# EAGLE design v3s-v0.1.2 (EAGLE 9.2.0)

## Sheet 1 of 5
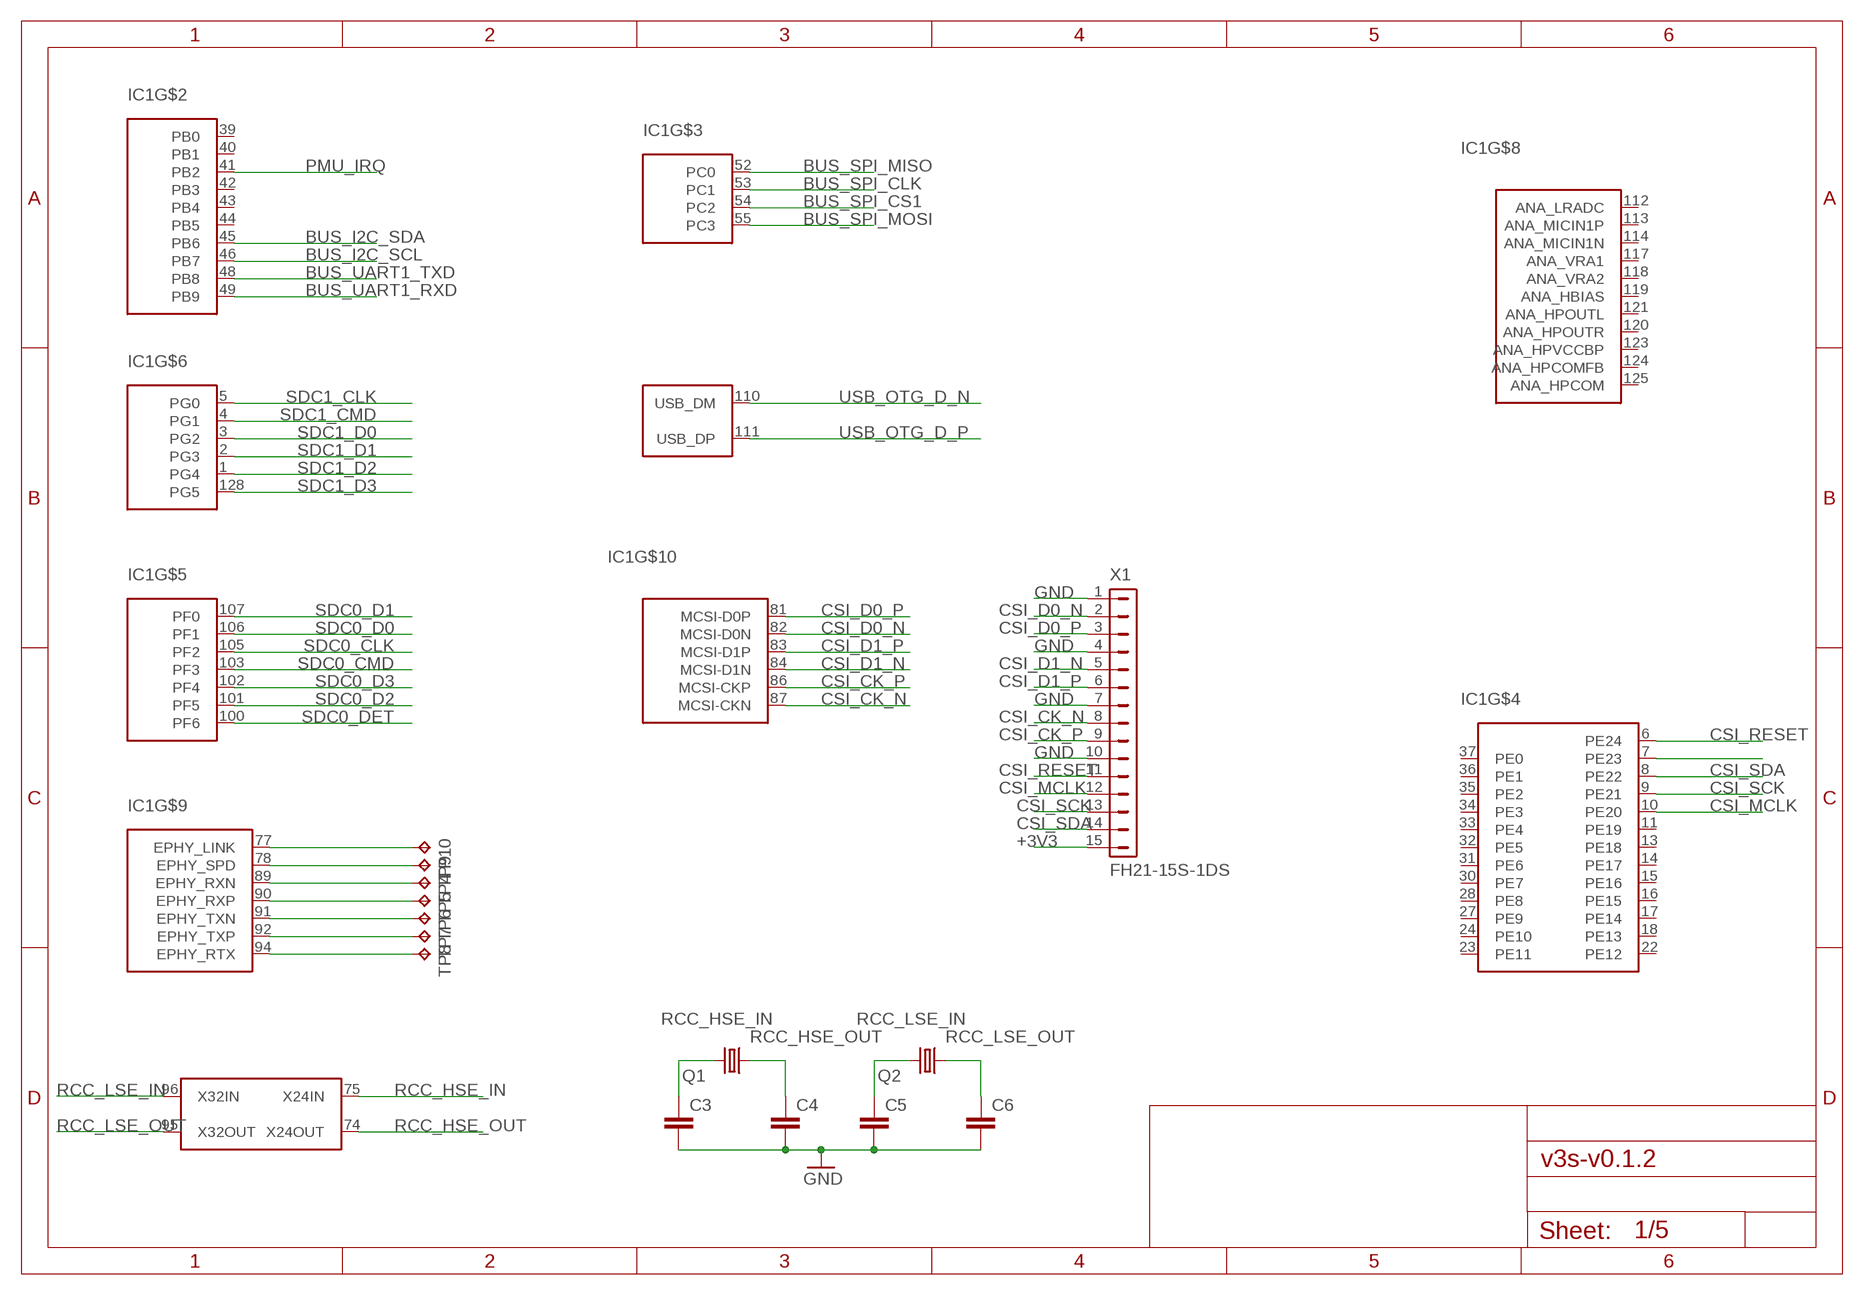
[diagram p0: schematic, sheet 1]

### Parts
C3  C-EUC0402  [C0402]
C4  C-EUC0402  [C0402]
C5  C-EUC0402  [C0402]
C6  C-EUC0402  [C0402]
IC1  V3S  [QFP-128]
Q1  KX-7  [3.2X2.5_KX-7]
Q2  KX-327-NHF  [3.2X1.5]
TP4  TPB1,27  [B1,27]
TP5  TPB1,27  [B1,27]
TP6  TPB1,27  [B1,27]
TP7  TPB1,27  [B1,27]
TP8  TPB1,27  [B1,27]
TP9  TPB1,27  [B1,27]
TP10  TPB1,27  [B1,27]
X1  FH21-15S-1DS  [FH21-15S-1DS]

### Nets
+3V3: X1.15 ; also sheet 2,3,4,5
BUS_I2C_SCL: IC1.46(PB7) ; also sheet 3,4,5
BUS_I2C_SDA: IC1.45(PB6) ; also sheet 3,4,5
BUS_SPI_CLK: IC1.53(PC1) ; also sheet 4
BUS_SPI_CS1: IC1.54(PC2)
BUS_SPI_MISO: IC1.52(PC0) ; also sheet 4
BUS_SPI_MOSI: IC1.55(PC3) ; also sheet 4
BUS_UART1_RXD: IC1.49(PB9) ; also sheet 4
BUS_UART1_TXD: IC1.48(PB8) ; also sheet 4
CSI_CK_N: IC1.87(MCSI-CKN) X1.8
CSI_CK_P: IC1.86(MCSI-CKP) X1.9
CSI_D0_N: IC1.82(MCSI-D0N) X1.2
CSI_D0_P: IC1.81(MCSI-D0P) X1.3
CSI_D1_N: IC1.84(MCSI-D1N) X1.5
CSI_D1_P: IC1.83(MCSI-D1P) X1.6
CSI_MCLK: IC1.10(PE20) X1.12
CSI_RESET: IC1.6(PE24) X1.11
CSI_SCK: IC1.9(PE21) X1.13
CSI_SDA: IC1.8(PE22) X1.14
GND: C3.2 C4.2 C5.2 C6.2 X1.1 X1.4 X1.7 X1.10 ; also sheet 2,3,4,5
N$23: IC1.78(EPHY_SPD) TP9.TP
N$24: IC1.77(EPHY_LINK) TP10.TP
N$26: IC1.7(PE23)
N$37: IC1.94(EPHY_RTX) TP8.TP
N$38: IC1.92(EPHY_TXP) TP7.TP
N$39: IC1.91(EPHY_TXN) TP6.TP
N$40: IC1.90(EPHY_RXP) TP5.TP
N$41: IC1.89(EPHY_RXN) TP4.TP
PMU_IRQ: IC1.41(PB2) ; also sheet 3
RCC_HSE_IN: C3.1 IC1.75(X24IN) Q1.3
RCC_HSE_OUT: C4.1 IC1.74(X24OUT) Q1.1
RCC_LSE_IN: C5.1 IC1.96(X32IN) Q2.2
RCC_LSE_OUT: C6.1 IC1.95(X32OUT) Q2.1
SDC0_CLK: IC1.105(PF2) ; also sheet 4
SDC0_CMD: IC1.103(PF3) ; also sheet 4
SDC0_D0: IC1.106(PF1) ; also sheet 4
SDC0_D1: IC1.107(PF0) ; also sheet 4
SDC0_D2: IC1.101(PF5) ; also sheet 4
SDC0_D3: IC1.102(PF4) ; also sheet 4
SDC0_DET: IC1.100(PF6) ; also sheet 4
SDC1_CLK: IC1.5(PG0) ; also sheet 4
SDC1_CMD: IC1.4(PG1) ; also sheet 4
SDC1_D0: IC1.3(PG2) ; also sheet 4
SDC1_D1: IC1.2(PG3) ; also sheet 4
SDC1_D2: IC1.1(PG4) ; also sheet 4
SDC1_D3: IC1.128(PG5) ; also sheet 4
USB_OTG_D_N [usb_df]: IC1.110(USB_DM) ; also sheet 4
USB_OTG_D_P [usb_df]: IC1.111(USB_DP) ; also sheet 4
Unconnected: IC1.11(PE19) IC1.13(PE18) IC1.14(PE17) IC1.15(PE16) IC1.16(PE15) IC1.17(PE14) IC1.18(PE13) IC1.22(PE12) IC1.23(PE11) IC1.24(PE10) IC1.27(PE9) IC1.28(PE8) IC1.30(PE7) IC1.31(PE6) IC1.32(PE5) IC1.33(PE4) IC1.34(PE3) IC1.35(PE2) IC1.36(PE1) IC1.37(PE0) IC1.39(PB0) IC1.40(PB1) IC1.42(PB3) IC1.43(PB4) IC1.44(PB5) IC1.112(ANA_LRADC) IC1.113(ANA_MICIN1P) IC1.114(ANA_MICIN1N) IC1.117(ANA_VRA1) IC1.118(ANA_VRA2) IC1.119(ANA_HBIAS) IC1.120(ANA_HPOUTR) IC1.121(ANA_HPOUTL) IC1.123(ANA_HPVCCBP) IC1.124(ANA_HPCOMFB) IC1.125(ANA_HPCOM)

## Sheet 2 of 5
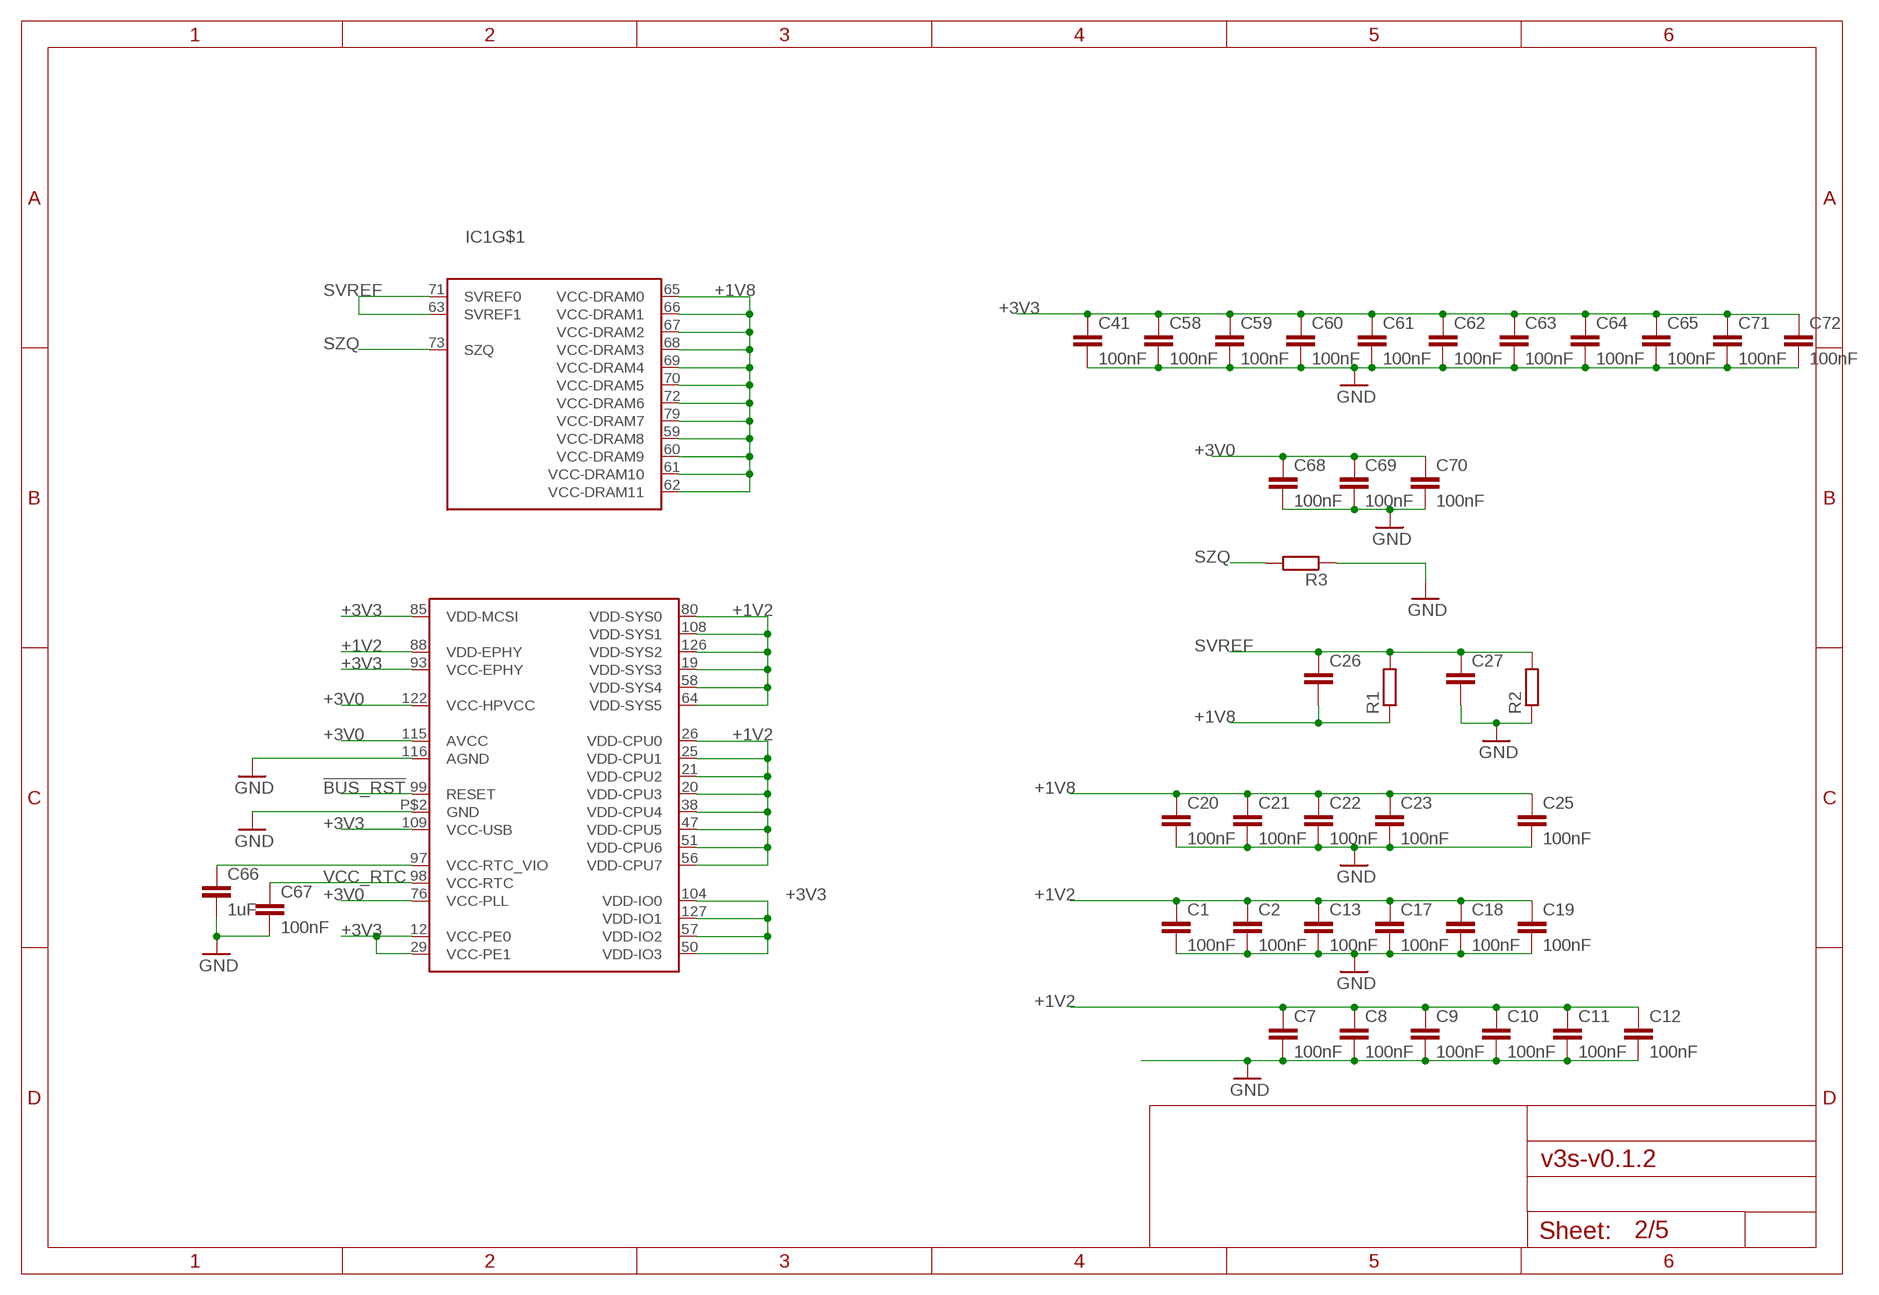
[diagram p1: schematic, sheet 2]

### Parts
C1  100nF  C-EUC0402  [C0402]
C2  100nF  C-EUC0402  [C0402]
C7  100nF  C-EUC0402  [C0402]
C8  100nF  C-EUC0402  [C0402]
C9  100nF  C-EUC0402  [C0402]
C10  100nF  C-EUC0402  [C0402]
C11  100nF  C-EUC0402  [C0402]
C12  100nF  C-EUC0402  [C0402]
C13  100nF  C-EUC0402  [C0402]
C17  100nF  C-EUC0402  [C0402]
C18  100nF  C-EUC0402  [C0402]
C19  100nF  C-EUC0402  [C0402]
C20  100nF  C-EUC0402  [C0402]
C21  100nF  C-EUC0402  [C0402]
C22  100nF  C-EUC0402  [C0402]
C23  100nF  C-EUC0402  [C0402]
C25  100nF  C-EUC0402  [C0402]
C26  C-EUC0402  [C0402]
C27  C-EUC0402  [C0402]
C41  100nF  C-EUC0402  [C0402]
C58  100nF  C-EUC0402  [C0402]
C59  100nF  C-EUC0402  [C0402]
C60  100nF  C-EUC0402  [C0402]
C61  100nF  C-EUC0402  [C0402]
C62  100nF  C-EUC0402  [C0402]
C63  100nF  C-EUC0402  [C0402]
C64  100nF  C-EUC0402  [C0402]
C65  100nF  C-EUC0402  [C0402]
C66  1uF  C-EUC0402  [C0402]
C67  100nF  C-EUC0402  [C0402]
C68  100nF  C-EUC0402  [C0402]
C69  100nF  C-EUC0402  [C0402]
C70  100nF  C-EUC0402  [C0402]
C71  100nF  C-EUC0402  [C0402]
C72  100nF  C-EUC0402  [C0402]
R1  R-EU_R0402  [R0402]
R2  R-EU_R0402  [R0402]
R3  R-EU_R0402  [R0402]

### Nets
!BUS_RST: IC1.99(RESET) ; also sheet 3,4
+1V2: C1.1 C2.1 C7.1 C8.1 C9.1 C10.1 C11.1 C12.1 C13.1 C17.1 C18.1 C19.1 IC1.19(VDD-SYS3) IC1.20(VDD-CPU3) IC1.21(VDD-CPU2) IC1.25(VDD-CPU1) IC1.26(VDD-CPU0) IC1.38(VDD-CPU4) IC1.47(VDD-CPU5) IC1.51(VDD-CPU6) IC1.56(VDD-CPU7) IC1.58(VDD-SYS4) IC1.64(VDD-SYS5) IC1.80(VDD-SYS0) IC1.88(VDD-EPHY) IC1.108(VDD-SYS1) IC1.126(VDD-SYS2) ; also sheet 3
+1V8: C20.1 C21.1 C22.1 C23.1 C25.1 C26.2 IC1.59(VCC-DRAM8) IC1.60(VCC-DRAM9) IC1.61(VCC-DRAM10) IC1.62(VCC-DRAM11) IC1.65(VCC-DRAM0) IC1.66(VCC-DRAM1) IC1.67(VCC-DRAM2) IC1.68(VCC-DRAM3) IC1.69(VCC-DRAM4) IC1.70(VCC-DRAM5) IC1.72(VCC-DRAM6) IC1.79(VCC-DRAM7) R1.1 ; also sheet 3
+3V0: C68.1 C69.1 C70.1 IC1.76(VCC-PLL) IC1.115(AVCC) IC1.122(VCC-HPVCC) ; also sheet 3
+3V3: C41.1 C58.1 C59.1 C60.1 C61.1 C62.1 C63.1 C64.1 C65.1 C71.1 C72.1 IC1.12(VCC-PE0) IC1.29(VCC-PE1) IC1.50(VDD-IO3) IC1.57(VDD-IO2) IC1.85(VDD-MCSI) IC1.93(VCC-EPHY) IC1.104(VDD-IO0) IC1.109(VCC-USB) IC1.127(VDD-IO1) ; also sheet 1,3,4,5
GND: C1.2 C2.2 C7.2 C8.2 C9.2 C10.2 C11.2 C12.2 C13.2 C17.2 C18.2 C19.2 C20.2 C21.2 C22.2 C23.2 C25.2 C27.2 C41.2 C58.2 C59.2 C60.2 C61.2 C62.2 C63.2 C64.2 C65.2 C66.2 C67.2 C68.2 C69.2 C70.2 C71.2 C72.2 IC1.116(AGND) IC1.P$2(GND) R2.1 R3.1 ; also sheet 1,3,4,5
N$25: C66.1 IC1.97(VCC-RTC_VIO)
SVREF: C26.1 C27.1 IC1.63(SVREF1) IC1.71(SVREF0) R1.2 R2.2
SZQ: IC1.73(SZQ) R3.2
VCC_RTC: C67.1 IC1.98(VCC-RTC) ; also sheet 3

## Sheet 3 of 5
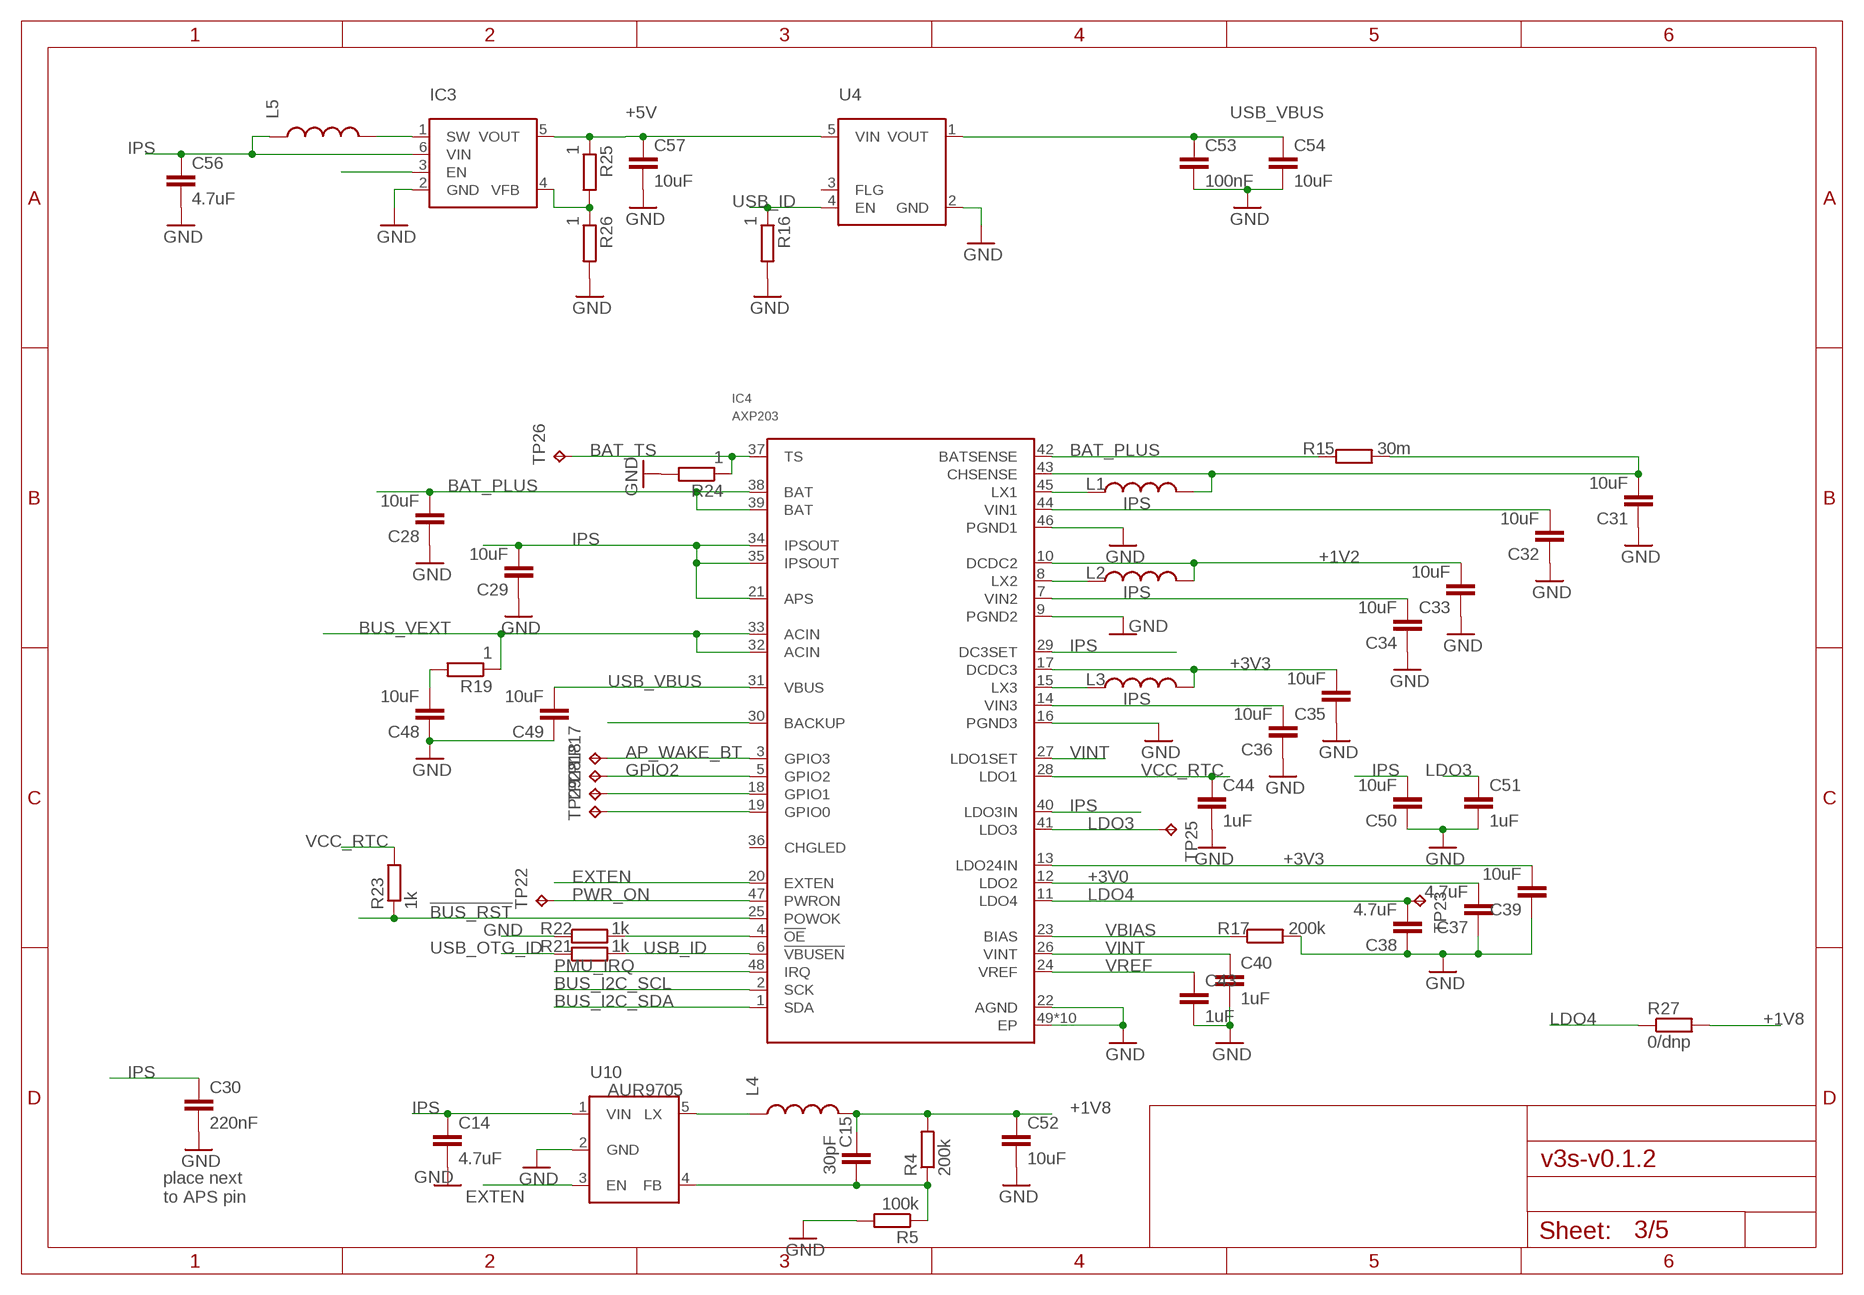
[diagram p2: schematic, sheet 3]

### Parts
C14  4.7uF  C-EUC0603  [C0603]
C15  30pF  C-EUC0402  [C0402]
C28  10uF  C-EUC0603  [C0603]
C29  10uF  C-EUC0603  [C0603]
C30  220nF  C-EUC0402  [C0402]
C31  10uF  C-EUC0603  [C0603]
C32  10uF  C-EUC0603  [C0603]
C33  10uF  C-EUC0603  [C0603]
C34  10uF  C-EUC0603  [C0603]
C35  10uF  C-EUC0603  [C0603]
C36  10uF  C-EUC0603  [C0603]
C37  4.7uF  C-EUC0603  [C0603]
C38  4.7uF  C-EUC0603  [C0603]
C39  10uF  C-EUC0603  [C0603]
C40  1uF  C-EUC0402  [C0402]
C43  1uF  C-EUC0402  [C0402]
C44  1uF  C-EUC0402  [C0402]
C48  10uF  C-EUC0603  [C0603]
C49  10uF  C-EUC0603  [C0603]
C50  10uF  C-EUC0603  [C0603]
C51  1uF  C-EUC0402  [C0402]
C52  10uF  C-EUC0603  [C0603]
C53  100nF  C-EUC0402  [C0402]
C54  10uF  C-EUC0603  [C0603]
C56  4.7uF  C-EUC0603  [C0603]
C57  10uF  C-EUC0603  [C0603]
IC3  MCP1640  [SOT95P280X110-6]
IC4  AXP203  [QFN40P600X600X80-49T405]
L1  DJNR3015  [L3230M]
L2  DJNR3015  [L3230M]
L3  DJNR3015  [L3230M]
L4  DJNR3015  [L3230M]
L5  DJNR3015  [L3230M]
R4  200k  R-EU_R0402  [R0402]
R5  100k  R-EU_R0402  [R0402]
R15  30m  R-EU_R0805  [R0805]
R16  1  R-EU_R0402  [R0402]
R17  200k  R-EU_R0402  [R0402]
R19  1  R-EU_R0402  [R0402]
R21  1k  R-EU_R0402  [R0402]
R22  1k  R-EU_R0402  [R0402]
R23  1k  R-EU_R0402  [R0402]
R24  1  R-EU_R0402  [R0402]
R25  1  R-EU_R0402  [R0402]
R26  1  R-EU_R0402  [R0402]
R27  0/dnp  R-EU_R0402  [R0402]
TP17  TPB1,27  [B1,27]
TP18  TPB1,27  [B1,27]
TP22  TPB1,27  [B1,27]
TP23  TPB1,27  [B1,27]
TP25  TPB1,27  [B1,27]
TP26  TPB1,27  [B1,27]
TP28  TPB1,27  [B1,27]
TP29  TPB1,27  [B1,27]
U4  AP22802  [SOT25]
U10  AUR9705  [SOT25]

### Nets
!BUS_RST: IC4.25(POWOK) R23.1 ; also sheet 2,4
+1V2: C33.2 IC4.10(DCDC2) L2.2 ; also sheet 2
+1V8: C15.1 C52.1 L4.2 R4.2 R27.2 ; also sheet 2
+3V0: C37.2 IC4.12(LDO2) ; also sheet 2
+3V3: C35.2 C39.2 IC4.13(LDO24IN) IC4.17(DCDC3) L3.2 ; also sheet 1,2,4,5
+5V: C57.1 IC3.5(VOUT) R25.1 U4.5(VIN)
AP_WAKE_BT: IC4.3(GPIO3) TP17.TP
BAT_PLUS: C28.2 IC4.38(BAT) IC4.39(BAT) IC4.42(BATSENSE) R15.1 ; also sheet 4,5
BAT_TS: IC4.37(TS) R24.1 TP26.TP
BUS_I2C_SCL: IC4.2(SCK) ; also sheet 1,4,5
BUS_I2C_SDA: IC4.1(SDA) ; also sheet 1,4,5
BUS_VEXT: IC4.32(ACIN) IC4.33(ACIN) R19.1 ; also sheet 4
EXTEN: IC4.20(EXTEN) U10.3(EN)
GND: C14.2 C28.1 C29.1 C30.2 C31.1 C32.1 C33.1 C34.1 C35.1 C36.1 C37.1 C38.1 C39.1 C40.2 C43.2 C44.2 C48.1 C49.1 C50.1 C51.2 C52.2 C53.2 C54.2 C56.2 C57.2 IC3.2(GND) IC4.9(PGND2) IC4.16(PGND3) IC4.22(AGND) IC4.46(PGND1) IC4.49(EP) IC4.P$1(EP) IC4.P$2(EP) IC4.P$3(EP) IC4.P$4(EP) IC4.P$5(EP) IC4.P$6(EP) IC4.P$7(EP) IC4.P$8(EP) IC4.P$9(EP) R5.2 R16.2 R17.2 R22.1 R24.2 R26.2 U4.2(GND) U10.2(GND) ; also sheet 1,2,4,5
GPIO2: IC4.5(GPIO2) TP18.TP
IPS: C14.1 C29.2 C30.1 C32.2 C34.2 C36.2 C50.2 C56.1 IC3.6(VIN) IC4.7(VIN2) IC4.14(VIN3) IC4.21(APS) IC4.29(DC3SET) IC4.34(IPSOUT) IC4.35(IPSOUT) IC4.40(LDO3IN) IC4.44(VIN1) L5.1 U10.1(VIN)
LDO3: C51.1 IC4.41(LDO3) TP25.TP
LDO4: C38.2 IC4.11(LDO4) R27.1 TP23.TP
N$3: IC4.15(LX3) L3.1
N$4: IC4.18(GPIO1) TP28.TP
N$5: IC4.19(GPIO0) TP29.TP
N$6: L4.1 U10.5(LX)
N$8: C15.2 R4.1 R5.1 U10.4(FB)
N$9: IC4.30(BACKUP)
N$14: IC3.1(SW) L5.2
N$16: IC3.3(EN)
N$17: IC4.8(LX2) L2.1
N$19: IC3.4(VFB) R25.2 R26.1
N$20: IC4.45(LX1) L1.1
N$21: C31.2 IC4.43(CHSENSE) L1.2 R15.2
N$31: IC4.4(!OE) R22.2
N$68: C48.2 R19.2
PMU_IRQ: IC4.48(IRQ) ; also sheet 1
PWR_ON: IC4.47(PWRON) TP22.TP
USB_ID: IC4.6(!VBUSEN) R16.1 R21.2 U4.4(EN)
USB_OTG_ID: R21.1 ; also sheet 4
USB_VBUS: C49.2 C53.1 C54.1 IC4.31(VBUS) U4.1(VOUT) ; also sheet 4
VBIAS: IC4.23(BIAS) R17.1
VCC_RTC: C44.1 IC4.28(LDO1) R23.2 ; also sheet 2
VINT: C40.1 IC4.26(VINT) IC4.27(LDO1SET)
VREF: C43.1 IC4.24(VREF)
Unconnected: IC4.36(CHGLED) U4.3(FLG)

### Notes on the sheet
- place next
  to APS pin

## Sheet 4 of 5
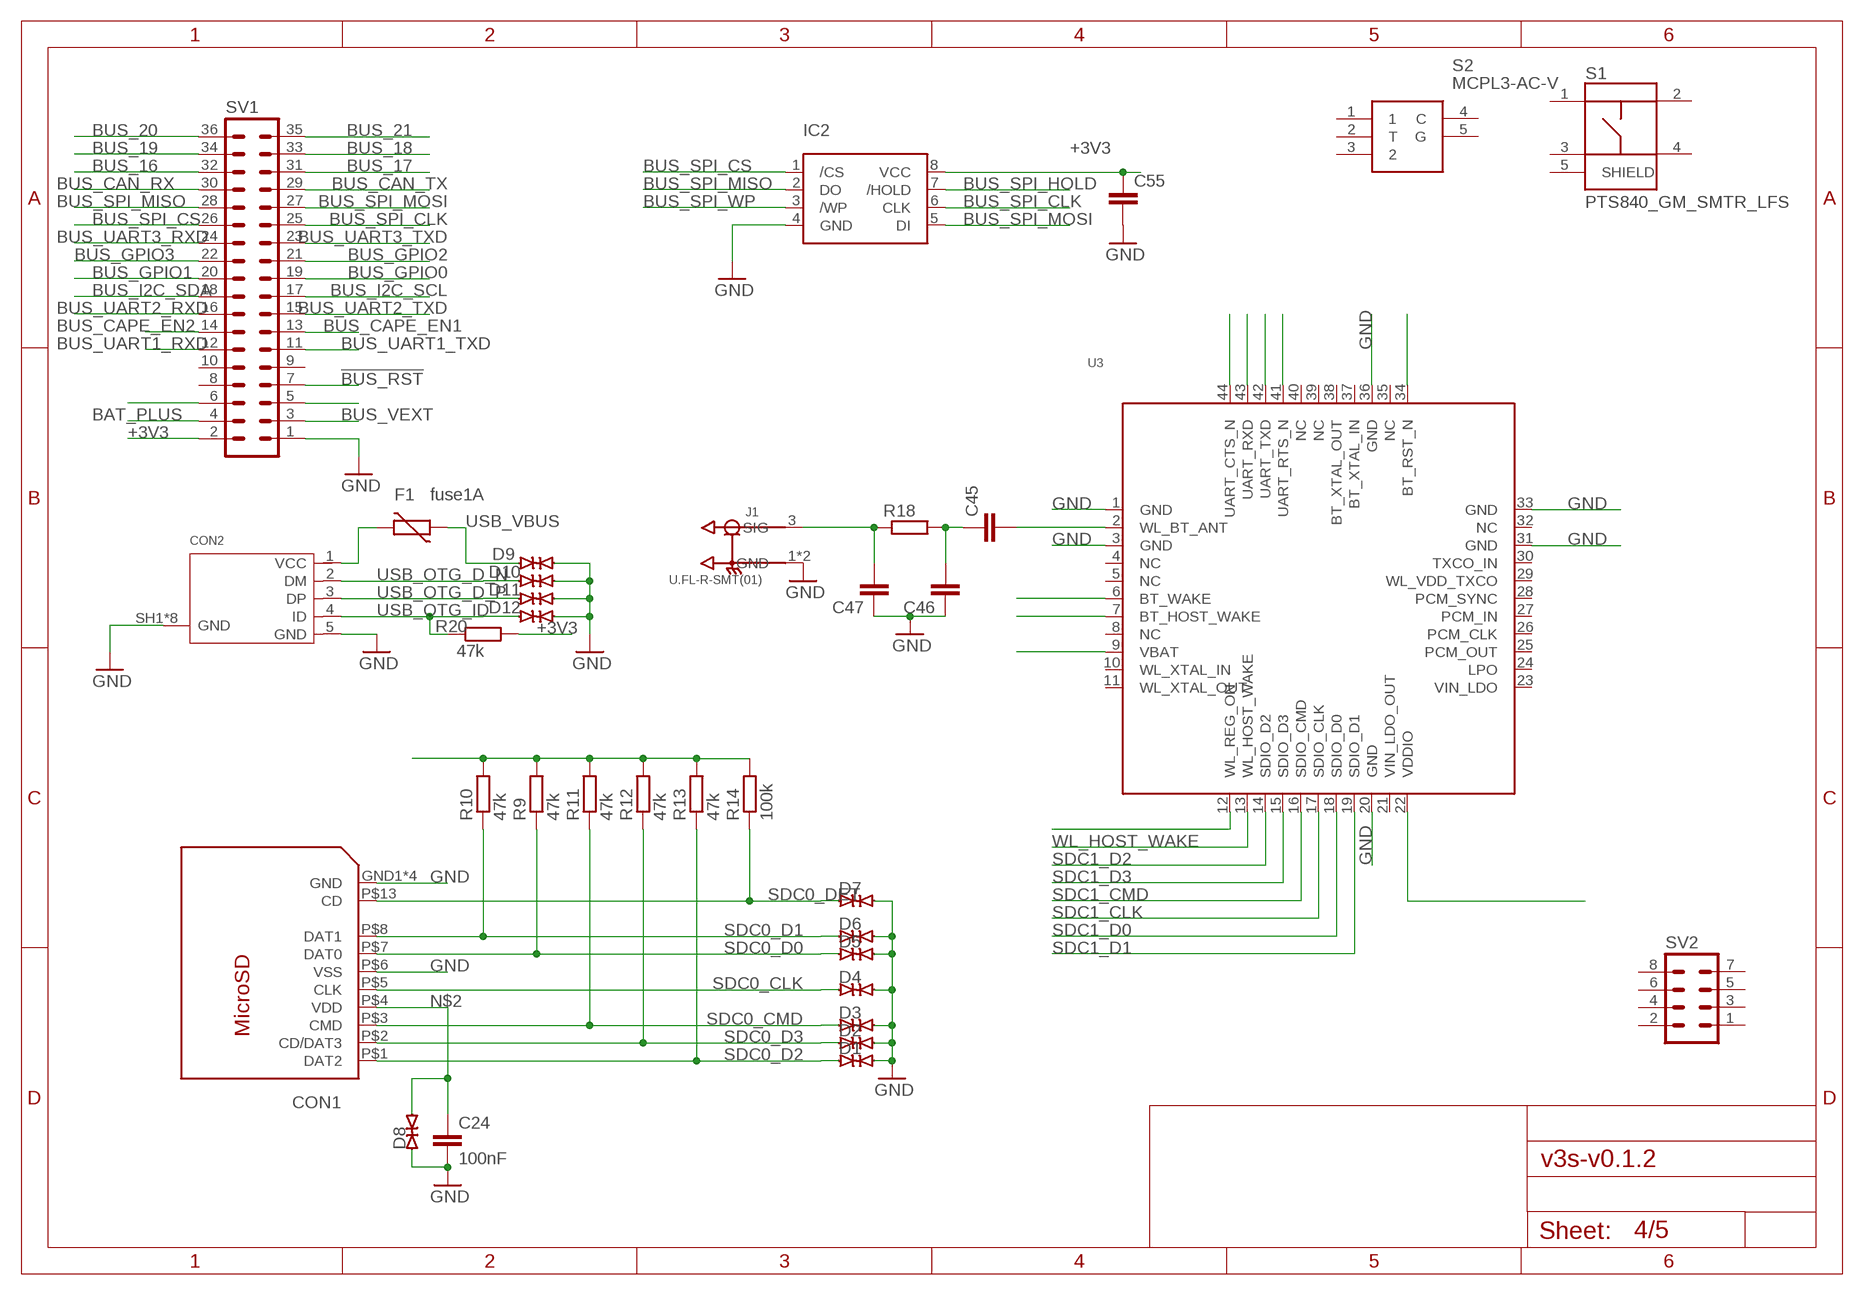
[diagram p3: schematic, sheet 4]

### Parts
C24  100nF  C-EUC0402  [C0402]
C45  C-EUC0402  [C0402]
C46  C-EUC0402  [C0402]
C47  C-EUC0402  [C0402]
C55  C-EUC0603  [C0603]
CON1  112J-TXAR  [112J]
CON2  10118194-0001LF  [10118194]
D1  ESD9B5.0ST5G  [SOD1006X40]
D2  ESD9B5.0ST5G  [SOD1006X40]
D3  ESD9B5.0ST5G  [SOD1006X40]
D4  ESD9B5.0ST5G  [SOD1006X40]
D5  ESD9B5.0ST5G  [SOD1006X40]
D6  ESD9B5.0ST5G  [SOD1006X40]
D7  ESD9B5.0ST5G  [SOD1006X40]
D8  ESD9B5.0ST5G  [SOD1006X40]
D9  ESD9B5.0ST5G  [SOD1006X40]
D10  ESD9B5.0ST5G  [SOD1006X40]
D11  ESD9B5.0ST5G  [SOD1006X40]
D12  ESD9B5.0ST5G  [SOD1006X40]
F1  fuse1A  VARISTORCN0603  [CT/CN0603]
IC2  W25Q128JV  [SO08-208]
J1  U.FL-R-SMT(01)  [HRS_U.FL-R-SMT(01)]
R9  47k  R-EU_R0402  [R0402]
R10  47k  R-EU_R0402  [R0402]
R11  47k  R-EU_R0402  [R0402]
R12  47k  R-EU_R0402  [R0402]
R13  47k  R-EU_R0402  [R0402]
R14  100k  R-EU_R0402  [R0402]
R18  R-EU_R0402  [R0402]
R20  47k  R-EU_R0402  [R0402]
S1  PTS840_GM_SMTR_LFS  [SW_PTS840GMSMTRLFS]
S2  MCPL3-AC-V  [MCPL3-AC-V]
SV1  MA18-2  [MA18-2]
SV2  MA04-2  [MA04-2]
U3  RTL8723BS  [QFN90P1200X1200X100-44]

### Nets
!BUS_RST: SV1.7 ; also sheet 2,3
+3V3: C55.1 IC2.8(VCC) R20.2 SV1.2 ; also sheet 1,2,3,5
BAT_PLUS: SV1.4 ; also sheet 3,5
BUS_16: SV1.32
BUS_17: SV1.31
BUS_18: SV1.33
BUS_19: SV1.34
BUS_20: SV1.36
BUS_21: SV1.35
BUS_CAN_RX: SV1.30
BUS_CAN_TX: SV1.29
BUS_CAPE_EN1: SV1.13
BUS_CAPE_EN2: SV1.14
BUS_GPIO0: SV1.19
BUS_GPIO1: SV1.20
BUS_GPIO2: SV1.21
BUS_GPIO3: SV1.22
BUS_I2C_SCL: SV1.17 ; also sheet 1,3,5
BUS_I2C_SDA: SV1.18 ; also sheet 1,3,5
BUS_SPI_CLK: IC2.6(CLK) SV1.25 ; also sheet 1
BUS_SPI_CS: IC2.1(/CS) SV1.26
BUS_SPI_HOLD: IC2.7(/HOLD)
BUS_SPI_MISO: IC2.2(DO) SV1.28 ; also sheet 1
BUS_SPI_MOSI: IC2.5(DI) SV1.27 ; also sheet 1
BUS_SPI_WP: IC2.3(/WP)
BUS_UART1_RXD: SV1.12 ; also sheet 1
BUS_UART1_TXD: SV1.11 ; also sheet 1
BUS_UART2_RXD: SV1.16
BUS_UART2_TXD: SV1.15
BUS_UART3_RXD: SV1.24
BUS_UART3_TXD: SV1.23
BUS_VEXT: SV1.3 ; also sheet 3
GND: C24.2 C46.1 C47.1 C55.2 CON1.GND1(GND) CON1.GND2(GND) CON1.GND3(GND) CON1.GND4(GND) CON1.P$6(VSS) CON2.5(GND) CON2.SH1(GND) CON2.SH2(GND) CON2.SH3(GND) CON2.SH4(GND) CON2.SH5(GND) CON2.SH6(GND) CON2.SH7(GND) CON2.SH8(GND) D1.2(C) D2.2(C) D3.2(C) D4.2(C) D5.2(C) D6.2(C) D7.2(C) D8.1(A) D9.2(C) D10.2(C) D11.2(C) D12.2(C) IC2.4(GND) J1.1(GND) J1.2(GND) SV1.1 U3.1(GND) U3.3(GND) U3.20(GND) U3.31(GND) U3.33(GND) U3.36(GND) ; also sheet 1,2,3,5
N$1: R9.2 R10.2 R11.2 R12.2 R13.2 R14.2
N$2: C24.1 CON1.P$4(VDD) D8.2(C)
N$7: CON2.1(VCC) F1.2
N$15: SV1.6
N$22: SV1.5
N$48: C45.2 U3.2(WL_BT_ANT)
N$49: C45.1 C46.2 R18.2
N$50: C47.2 J1.3(SIG) R18.1
N$51: U3.9(VBAT)
N$53: U3.12(WL_REG_ON)
N$60: U3.22(VDDIO)
N$61: U3.6(BT_WAKE)
N$62: U3.7(BT_HOST_WAKE)
N$63: U3.34(BT_RST_N)
N$64: U3.41(UART_RTS_N)
N$65: U3.42(UART_TXD)
N$66: U3.43(UART_RXD)
N$67: U3.44(UART_CTS_N)
SDC0_CLK: CON1.P$5(CLK) D4.1(A) ; also sheet 1
SDC0_CMD: CON1.P$3(CMD) D3.1(A) R11.1 ; also sheet 1
SDC0_D0: CON1.P$7(DAT0) D5.1(A) R9.1 ; also sheet 1
SDC0_D1: CON1.P$8(DAT1) D6.1(A) R10.1 ; also sheet 1
SDC0_D2: CON1.P$1(DAT2) D1.1(A) R13.1 ; also sheet 1
SDC0_D3: CON1.P$2(CD/DAT3) D2.1(A) R12.1 ; also sheet 1
SDC0_DET: CON1.P$13(CD) D7.1(A) R14.1 ; also sheet 1
SDC1_CLK: U3.17(SDIO_CLK) ; also sheet 1
SDC1_CMD: U3.16(SDIO_CMD) ; also sheet 1
SDC1_D0: U3.18(SDIO_D0) ; also sheet 1
SDC1_D1: U3.19(SDIO_D1) ; also sheet 1
SDC1_D2: U3.14(SDIO_D2) ; also sheet 1
SDC1_D3: U3.15(SDIO_D3) ; also sheet 1
USB_OTG_D_N [usb_df]: CON2.2(DM) D10.1(A) ; also sheet 1
USB_OTG_D_P [usb_df]: CON2.3(DP) D11.1(A) ; also sheet 1
USB_OTG_ID: CON2.4(ID) D12.1(A) R20.1 ; also sheet 3
USB_VBUS: D9.1(A) F1.1 ; also sheet 3
WL_HOST_WAKE: U3.13(WL_HOST_WAKE)
Unconnected: S1.1 S1.2 S1.3 S1.4 S1.5(SHIELD) S2.1 S2.2(T) S2.3 S2.4(C) S2.5(G) SV1.8 SV1.9 SV1.10 SV2.1 SV2.2 SV2.3 SV2.4 SV2.5 SV2.6 SV2.7 SV2.8 U3.4(NC) U3.5(NC) U3.8(NC) U3.10(WL_XTAL_IN) U3.11(WL_XTAL_OUT) U3.21(VIN_LDO_OUT) U3.23(VIN_LDO) U3.24(LPO) U3.25(PCM_OUT) U3.26(PCM_CLK) U3.27(PCM_IN) U3.28(PCM_SYNC) U3.29(WL_VDD_TXCO) U3.30(TXCO_IN) U3.32(NC) U3.35(NC) U3.37(BT_XTAL_IN) U3.38(BT_XTAL_OUT) U3.39(NC) U3.40(NC)

## Sheet 5 of 5
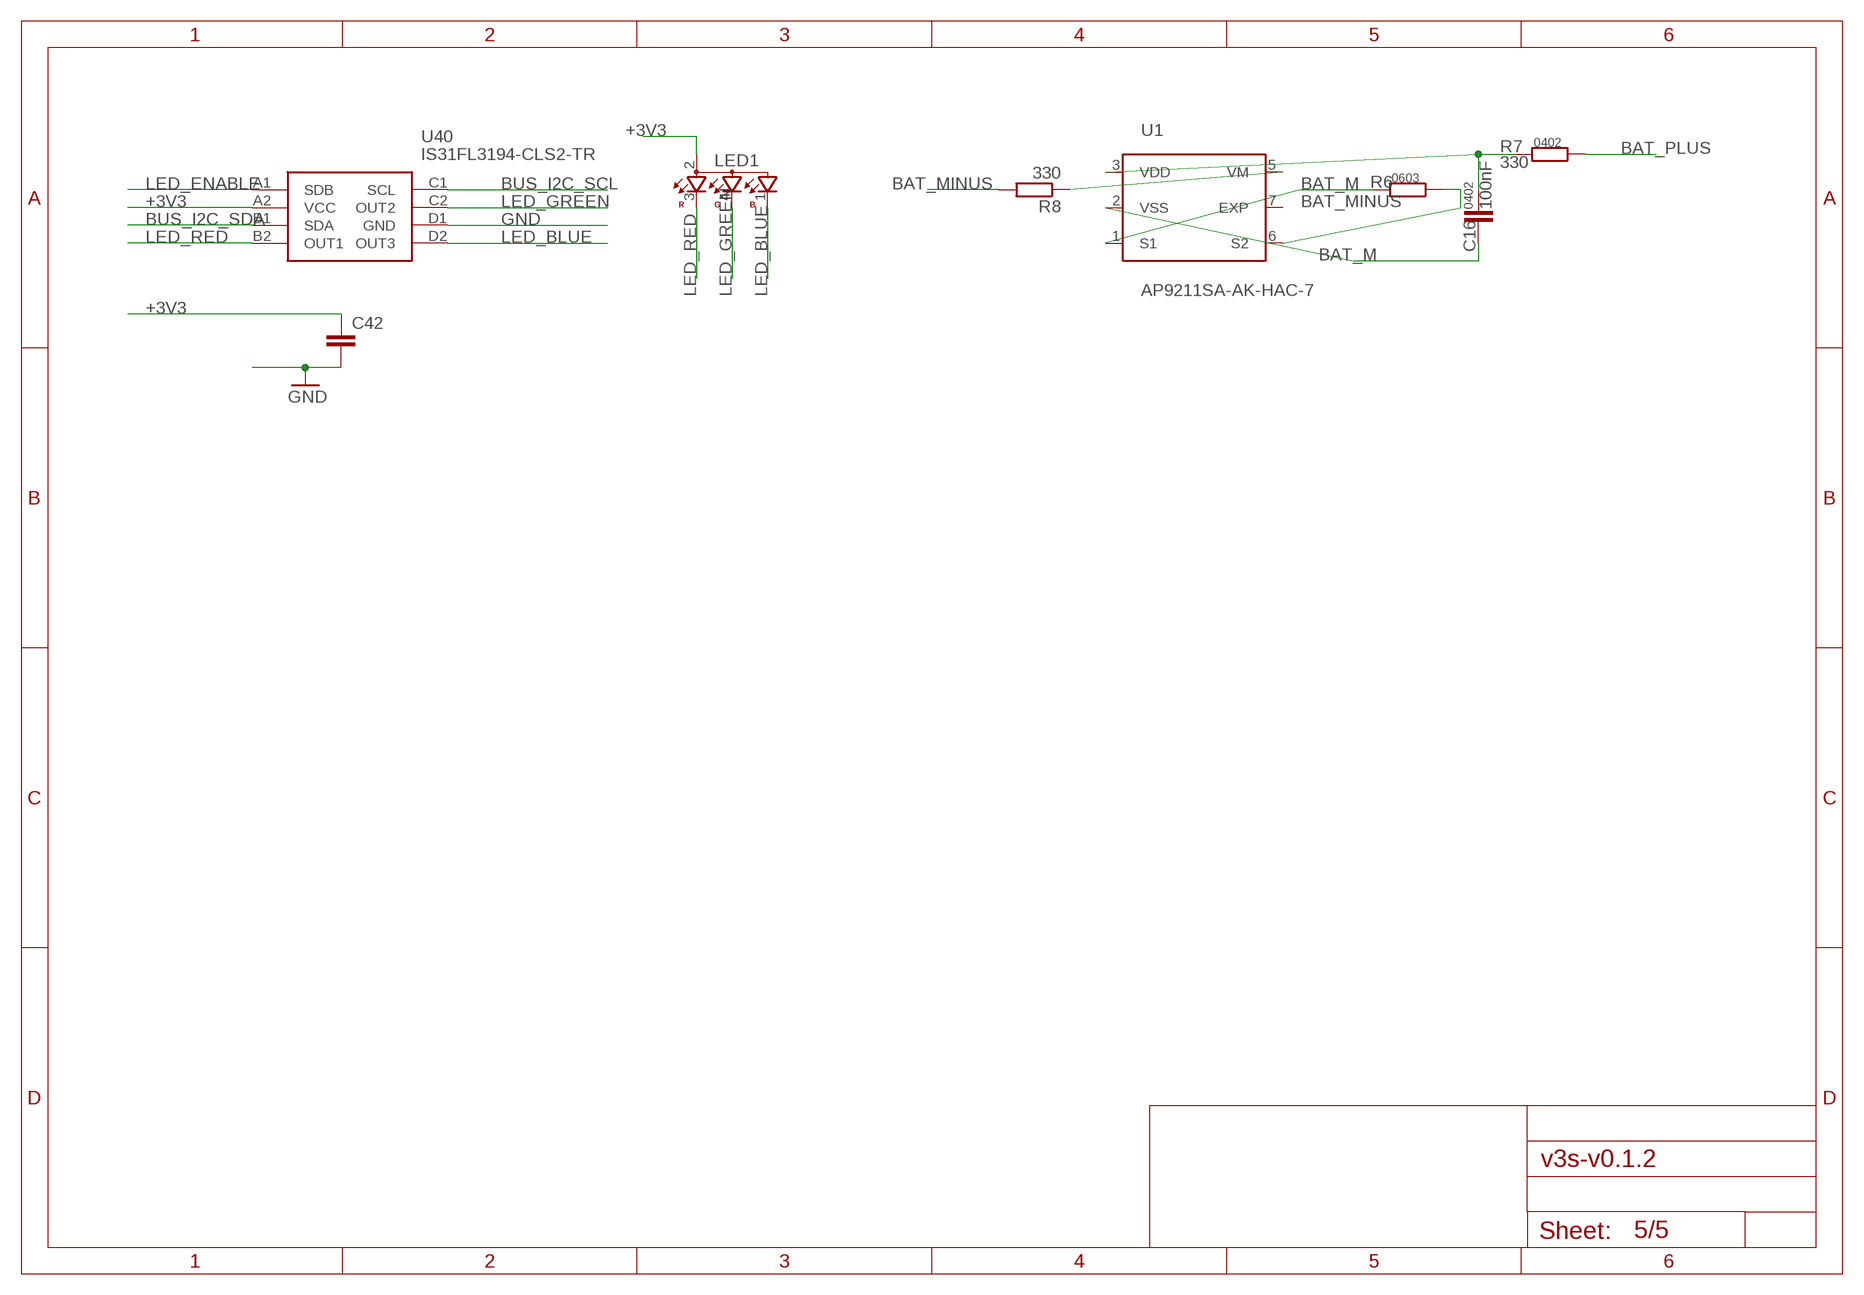
[diagram p4: schematic, sheet 5]

### Parts
C16  100nF  C-EUC0402  [C0402]
C42  C-EUC0402  [C0402]
LED1  OSTB1204C1E  [321015RGB]
R6  R-EU_R0603  [R0603]
R7  330  R-EU_R0402  [R0402]
R8  330  R-EU_R0402  [R0402]
U1  AP9211SA-AK-HAC-7  [DFN200X300X60-7N]
U40  IS31FL3194-CLS2-TR  [BGA8C40P2X4_99X159X42]

### Nets
+3V3: C42.1 LED1.2 U40.A2(VCC) ; also sheet 1,2,3,4
BAT_M: C16.2 R6.2 U1.1(S1) U1.2(VSS)
BAT_MINUS: R6.1 R8.2 U1.6(S2)
BAT_PLUS: R7.1 ; also sheet 3,4
BUS_I2C_SCL: U40.C1(SCL) ; also sheet 1,3,4
BUS_I2C_SDA: U40.B1(SDA) ; also sheet 1,3,4
GND: C42.2 U40.D1(GND) ; also sheet 1,2,3,4
LED_BLUE: LED1.1 U40.D2(OUT3)
LED_ENABLE: U40.A1(SDB)
LED_GREEN: LED1.4 U40.C2(OUT2)
LED_RED: LED1.3 U40.B2(OUT1)
N$13: C16.1 R7.2 U1.3(VDD)
N$18: R8.1 U1.5(VM)

### Notes on the sheet
- 0402
- 0603
- 0402

## Power pins joined to a net without a drawn wire
EXP: U1.7(EXP)

## Library data of the parts
C1-C72 = rcl:C-EU: CAPACITOR, European symbol; SPICEPREFIX: C
CON1 = parts-attend:112J-TXAR
CON2 = parts-amphenol:10118194-00
D1-D12 = parts-onsemi:ESD9B
F1 = varistor:VARISTOR: VARISTOR
IC1 = parts-allwinner:V3S
IC2 = parts-winbond:W25Q128JV
IC3 = parts-microchip:MCP1640
IC4 = parts-xpower:AXP203
J1 = U.FL-R-SMT_01_:U.FL-R-SMT(01): U.FL Series 6 Ghz 50 Ohm Ultra-small SMT Coaxial Cable Receptacle; AVAILABILITY: Unavailable; DESCRIPTION: U.FL Series 6 Ghz 50 Ohm Ultra-small SMT Coaxial Cable Receptacle; MF: Hirose; MP: U.FL-R-SMT_01_; PACKAGE: None; PRICE: None
L1-L5 = parts-ferrocore:DJNR3015
LED1 = parts-optosupply:OSTB1204
Q1 = crystal-geyer_V1_0:KX: Quartz Crystals (MHz) SMD: KX - Serie Model Size l/w/h [mm] Frequency Range Frequency Stability Temp. Range [°C] Load Capacitance AECQ 200 availabel Datasheet KX-4 KX-5 KX-6 KX-7 KX-9A KX-9B KX-12A KX-12B KX-13 KX-20 KX-K KX-KS 1.6/1.2/0.3 2.0/1.6/0.45 2.5/2.0/0.55 3.2/2.5/0.8 5.0/3.2/1.0 5.0/3.2/1.1 6.0/3.5/1.1 6.0/3.5/1.0 7.0/5.0 /1.3 11.6/5.5/1.6 12.3/4.5/4.2 12.3/4.5/3.2 24.0 ~ 80.0 MHz 16.0 ~ 80.0 MHz 12.0 ~ 80.0 MHz 8.0 ~ 60.0 MHz 7,68 ~ 300,0 MHz 8,0 ~ 50,0 MHz 8,0 ~ 150,0 MHz 8,0 ~ 50,0 MHz 6,0 ~ 160,0 MHz 3,579 ~ 25,0 MHz 3,579 ~ 70,0 MHz 3,579 ~ 70,0 MHz ±10 … ±50ppm ±10 … ±50ppm ±10 … ±50ppm ±10 … ±50ppm ±10 … ±50ppm ±10 … ±50ppm ±10 … ±50ppm ±10 … ±50ppm ±10 … ±50ppm ±50ppm ±10 … ±50ppm ±10 … ±50ppm (*) -40°C …+85°C (*) -40°C …+125°C (*) -40°C …+125°C (*) -40°C …+125°C (*) -40°C …+105°C (*) -40°C …+105°C (*) -40°C …+125°C (*) -40°C …+105°C (*) -40°C …+105°C (*) -40°C …+105°C (*) -40°C …+85°C (*) -40°C …+85°C 8, 8…16 8, 8…16 10, 8…16 12, 7…20 16, 10…20 16, 10…20 16, 10…20 16, 12…20 16, 12…20 16, 12…20 16, 12…30 16, 12…30 - yes yes yes - - - - - - - - KX-4.pdf <http://www.geyer-electronic.de/uploads/tx_userartikelfrequenz/GEYER-KX-4.pdf> KX-5.pdf <http://www.geyer-electronic.de/uploads/tx_userartikelfrequenz/GEYER-KX-5.pdf> KX-6.pdf <http://www.geyer-electronic.de/uploads/tx_userartikelfrequenz/GEYER-KX-6.pdf> KX-7.pdf <http://www.geyer-electronic.de/uploads/tx_userartikelfrequenz/GEYER-KX-7.pdf> KX-9A.pdf <http://www.geyer-electronic.de/uploads/tx_userartikelfrequenz/GEYER-KX-9A.pdf> KX-9B.pdf <http://www.geyer-electronic.de/uploads/tx_userartikelfrequenz/GEYER-KX-9B.pdf> KX-12A.pdf <http://www.geyer-electronic.de/uploads/tx_userartikelfrequenz/GEYER-KX-12A.pdf> KX-12B.pdf <http://www.geyer-electronic.de/uploads/tx_userartikelfrequenz/GEYER-KX-12B.pdf> KX-13.pdf <http://www.geyer-electronic.de/uploads/tx_userartikelfrequenz/GEYER-KX-13.pdf> KX-20.pdf <http://www.geyer-electronic.de/uploads/tx_userartikelfrequenz/GEYER-KX-20.pdf> KX-K.pdf <http://www.geyer-electronic.de/uploads/tx_userartikelfrequenz/GEYER-KX-K.pdf> KX-KS.pdf <http://www.geyer-electronic.de/uploads/tx_userartikelfrequenz/GEYER-KX-KS.pdf> <http://www.geyer-electronic.de/fileadmin/template/img/logo-geyer-electronic.png> Details see: http://www.geyer-electronic.de/Frequenz-Produkte.9.0.html Created 2016-06-07, Hans Locher 2016 (C) Geyer Quartz Technology KX4,KX5,KX6,KX7,KX9A,KX9B,KX12A,KX12B,KX13,KX20,KXK,KXKS;1612;2016;2520;3225;5032;6035;7050;11655;12345;1,6x1,2;2,0x1,6;2,5x2,0;3,2x2,5;5,0x3,2;6,0x3,5;7,0x5,0;11,6x5,5;12,3x4,5;12,3x4,5;1.6x1.2;2.0x1.6;2.5x2.0;3.2x2.5;5.0x3.2;6.0x3.5;7.0x5.0;11.6x5.5;12.3x4.5;12.3x4.5;
Q2 = crystal-geyer_V1_0:KX-327: Tuning Fork Crystals (kHz) SMD: KX327 - Serie Model Size l/w/h [mm] Frequency Range Frequency Stability Temp. Range [°C] Load Capacitance AECQ 200 availabel Datasheet KX-327VT KX-327FT KX-327RT KX-327NHT KX-327NHF KX-327L KX-327S 1.25/1.05/0.5 1.6/1.0/0.5 2.0/1.2/0.6 3.2/1.5/0.8 3.2/1.5/0.8 7.0/1.5/1.4 8.2/3.8/2.5 32,768 kHz 32,768 kHz 32,768 kHz 32,768 kHz 32,768 kHz 32,768 kHz 32,768 kHz ±10 … ±20ppm ±10 … ±20ppm ±10 … ±20ppm ±10 … ±20ppm ±10 … ±20ppm ±10 … ±20ppm ±5 … ±20ppm (*) -40°C …+85°C (*) -40°C …+85°C (*) -40°C …+85°C (*) -40°C …+85°C (*) -40°C …+125°C (*) -40°C …+85°C (*) -40°C …+85°C 7/9/12,5 7/9/12,5 7/9/12,6 7/9/12,5 9/12,5 7/9/12,5 6/12,5 - - - - yes - - KX-327VT.pdf <http://www.geyer-electronic.de/uploads/tx_userartikelfrequenz/GEYER-KX-327VT.pdf> KX-327FT.pdf <http://www.geyer-electronic.de/uploads/tx_userartikelfrequenz/GEYER-KX-327FT.pdf> KX-327RT.pdf <http://www.geyer-electronic.de/uploads/tx_userartikelfrequenz/GEYER-KX-327RT.pdf> KX-327NHT.pdf <http://www.geyer-electronic.de/uploads/tx_userartikelfrequenz/GEYER-KX-327NHT.pdf> KX-327NHF.pdf <http://www.geyer-electronic.de/uploads/tx_userartikelfrequenz/GEYER-KX-327NHF.pdf> KX-327L.pdf <http://www.geyer-electronic.de/uploads/tx_userartikelfrequenz/GEYER-KX-327L.pdf> KX-327S.pdf <http://www.geyer-electronic.de/uploads/tx_userartikelfrequenz/GEYER-KX-327S.pdf> <http://www.geyer-electronic.de/fileadmin/template/img/logo-geyer-electronic.png> Details see: http://www.geyer-electronic.de/Frequenz-Produkte.9.0.html Created 2016-06-07, Hans Locher 2016 (C) Geyer Quartz Technology KX327VT,KX327FT,KX327RT,KX327NHT,KX327NHF,KX327S,KX327L;125105;1610;2012;3215;7015;8238;1,25x1,05,1.25x1.05;1,6x1,0,1.6x1.0;2,0x1,2,2.0x1.2;3,2x1,5,3.2x1.5;8,2x3,8,8.2x3.8,7.0x1.5,7,0x1,532.768kHz
R1-R27 = rcl:R-EU_: RESISTOR, European symbol; SPICEPREFIX: R
S1 = parts_ck:PTS840_GM_SMTR_LFS: Switch Tactile N.O. SPST Button Gull Wing 0.05A 12VDC 100000Cycle 1.57N SMD T/R; AVAILABILITY: Unavailable; DESCRIPTION: Switch Tactile N.O. SPST Button Gull Wing 0.05A 12VDC 100000Cycle 1.57N SMD T/R; MF: C&K; MP: PTS840 GM SMTR LFS; PACKAGE: None; PRICE: None
S2 = multicomp:MCPL3-AC-V: MULTICOMP - MCPL3-AC-V - NAVIGATION SWITCH, 3WAY, SMD Source: Datasheet <http://www.farnell.com/datasheets/1673648.pdf>; ARROW_PART_NUMBER: MCPL3-AC-V; DESCRIPTION: MULTICOMP - MCPL3-AC-V - NAVIGATION SWITCH, 3WAY, SMD; HEIGHT: mm; MANUFACTURER_NAME: MULTICOMP; MANUFACTURER_PART_NUMBER: MCPL3-AC-V
SV1 = con-lstb:MA18-2: PIN HEADER; OC_FARNELL: unknown; OC_NEWARK: unknown
SV2 = con-lstb:MA04-2: PIN HEADER; OC_FARNELL: unknown; OC_NEWARK: unknown
TP4-TP10 TP17 TP18 TP22 TP23 TP25 TP26 TP28 TP29 = testpad:TP: Test pad
U1 = parts-diodes:AP9211SA-AK-HAC-7: Battery Protection Li-Ion Packs 2.4V to 4.25V 6-Pin UDFN T/R; AVAILABILITY: Unavailable; DESCRIPTION: Battery Protection Li-Ion Packs 2.4V to 4.25V 6-Pin UDFN T/R; MF: Diodes Inc.; MP: AP9211SA-AK-HAC-7; PACKAGE: UDFN-6 Diodes Inc.; PRICE: None
U3 = parts-realtek:RTL8723BS
U4 = parts-diodes:AP22802
U10 = parts-diodes:AUR9705
U40 = parts-issi:IS31FL3194-CLS2-TR: LED Lighting Drivers 3-Channel Fun LED Driver Source: Datasheet <https://componentsearchengine.com/Datasheets/1/IS31FL3194-CLS2-TR.pdf>; DESCRIPTION: LED Lighting Drivers 3-Channel Fun LED Driver; HEIGHT: 0.422mm; MANUFACTURER_NAME: Integrated Silicon Solution Inc.; MANUFACTURER_PART_NUMBER: IS31FL3194-CLS2-TR; MOUSER_PART_NUMBER: 870-IS31FL3194CLS2TR
X1 = con-hirose:FH21-15S-1DS: FPC CONNECTOR Source: con-hirose.lbr from Bob Starr <rtzaudio@mindspring.com>; OC_FARNELL: unknown; OC_NEWARK: unknown

## Net classes
1 usb_df: width 0.3 mm, drill 0.3 mm, clearance 0.3 mm

## Board
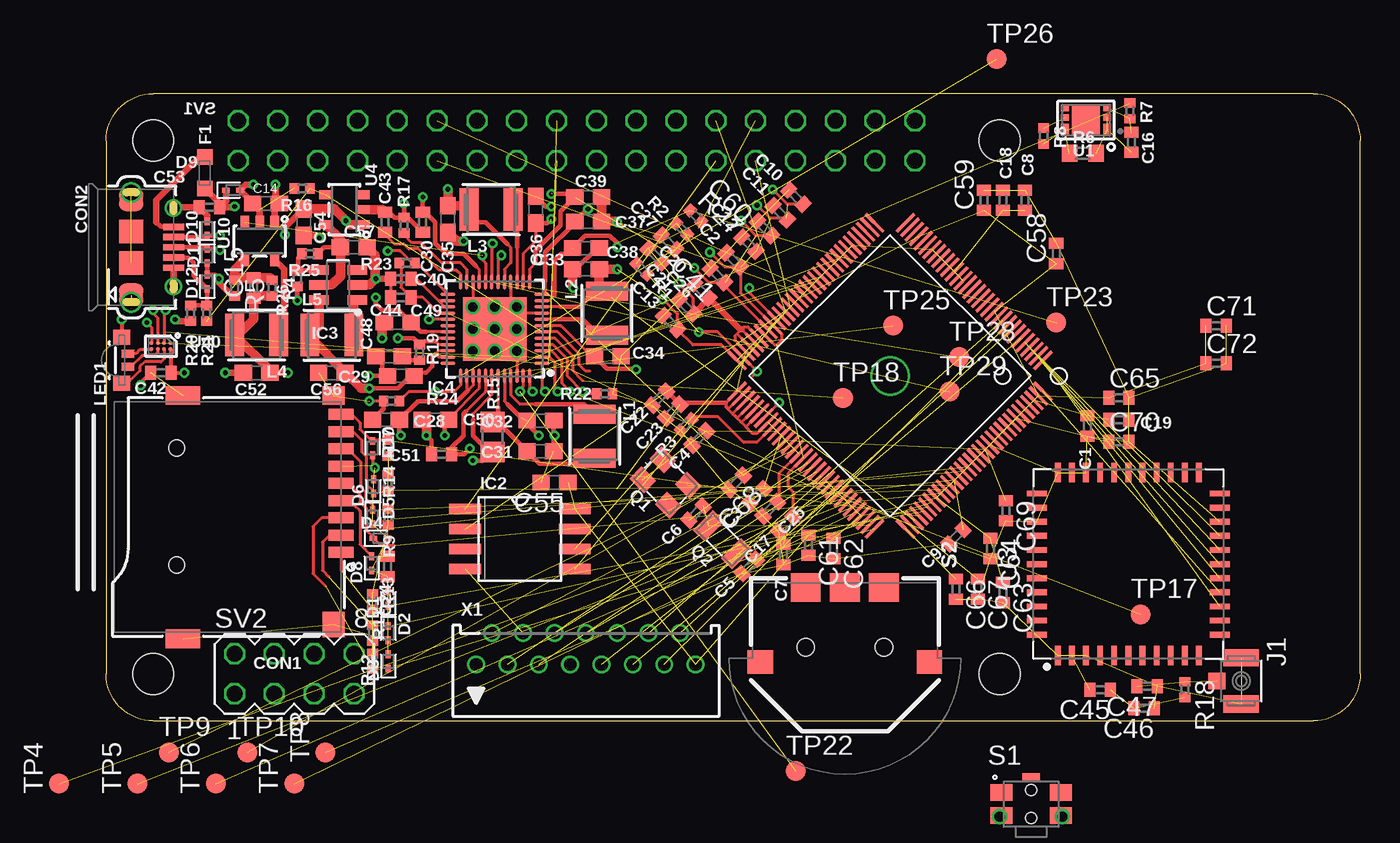
[diagram p5: board, top side]
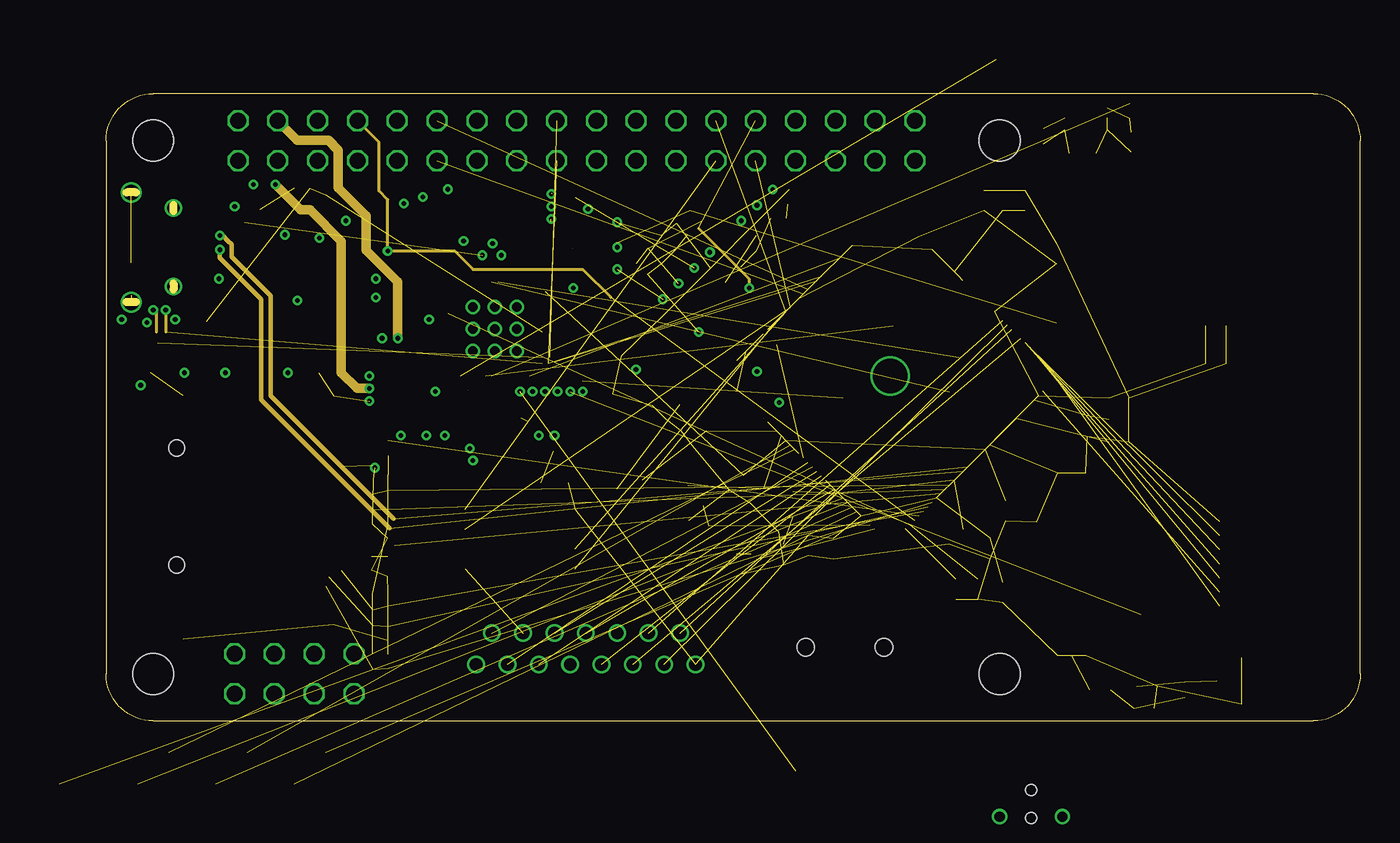
[diagram p6: board, inner layer Route2]
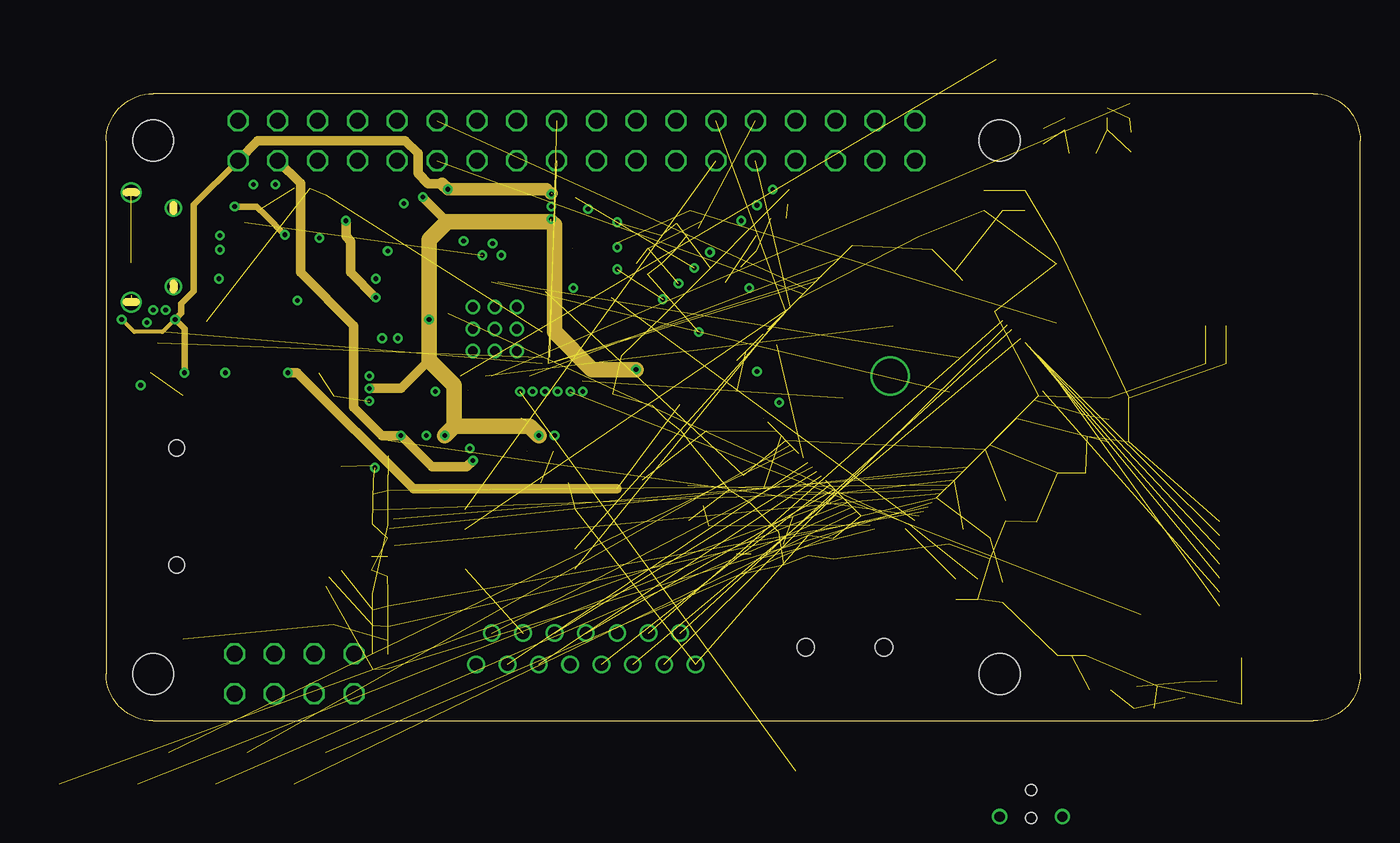
[diagram p7: board, inner layer Route15]
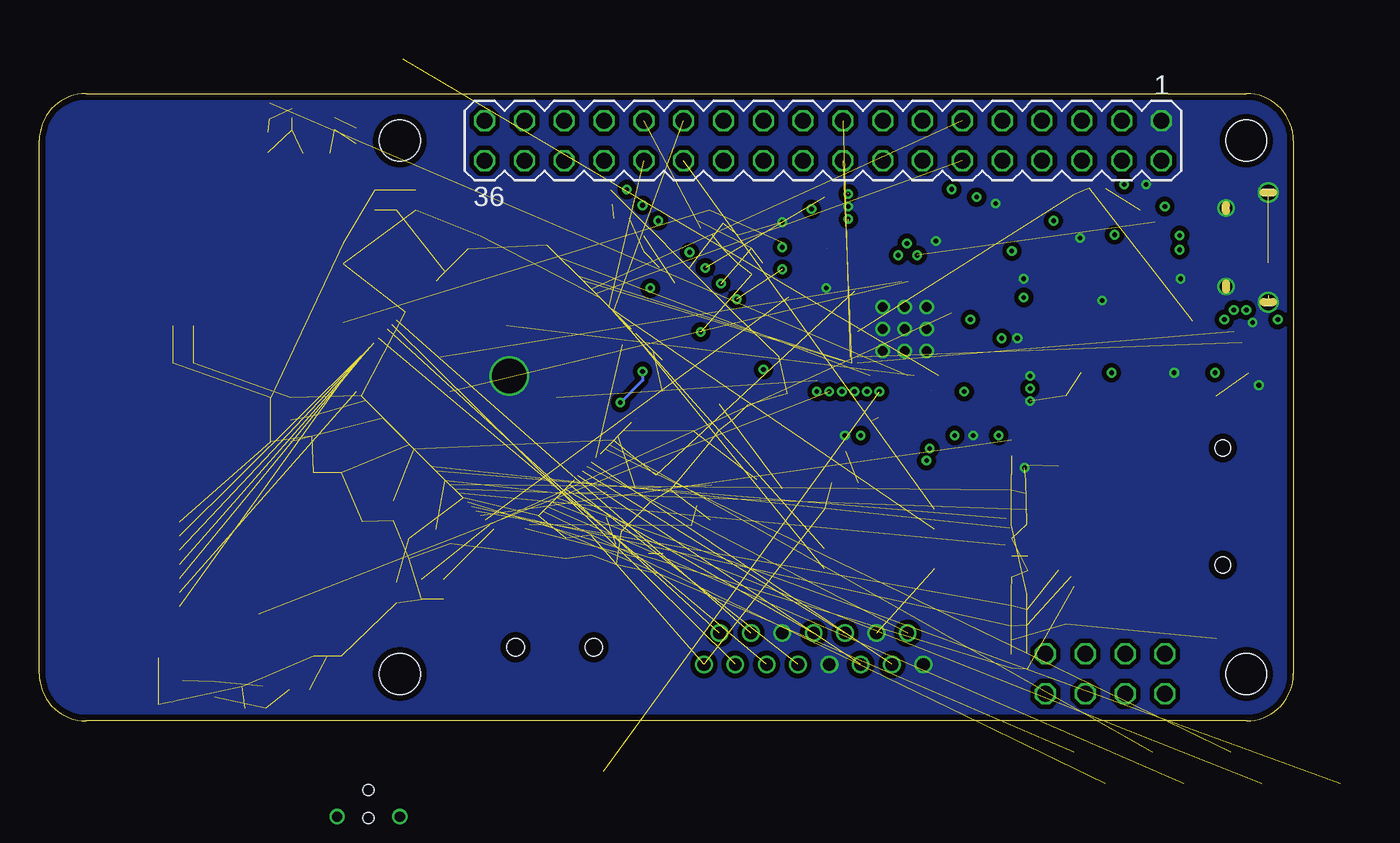
[diagram p8: board, bottom side, seen from below]

Size 80 x 40 mm. Coordinates in mm from the lower left corner, seen from the top.
Outline: 3,0 77,0 arc90 80,3 80,37 arc90 77,40 3,40 arc90 0,37 0,3 arc90 3,0
Copper layers (1*2*15*16): Top 0.035mm / dielectric 0.4mm / Route2 0.035mm / dielectric 0.4mm / Route15 0.035mm / dielectric 0.4mm / Bottom 0.035mm
Design rules "default *": minimum track width 0.16mm, minimum drill 0.3mm, track to track 6mil, track to pad 6mil, pad to pad 6mil, via to via 6mil, smd to smd 6mil, copper to edge 0.4mm, drill to drill 6mil, minimum pad ring 0.16mm, minimum via ring 0.16mm, stop-mask expansion 4mil, vias tented up to drill 0.4mm, thermal gap 10mil
Holes 2.6 mm at 3,3 3,37 57,37 57,3
tRestrict: area 0.5,34.5 to 5.5,39.5; area 54.5,34.5 to 59.5,39.5; area 74.5,34.5 to 79.5,39.5; area 54.5,0.5 to 59.5,5.5; area 0.5,0.5 to 5.5,5.5; area 74.5,0.5 to 79.5,5.5

### Footprints (pad centres in the part's own frame; a part is rotated, then mirrored left to right if it is on the bottom)
C0402 = smd 0.7 x 0.9: 1 -0.65,0; 2 0.65,0
C0603 = smd 1.1 x 1: 1 -0.85,0; 2 0.85,0
112J = smd 1.2 x 1.4: GND1 -7.75,-0.5 | smd 1.2 x 2.2: GND2 -7.75,-10.1; GND3 7.75,-10.1 | smd 1.6 x 1.4: GND4 6.85,-0.5 | smd 0.7 x 1.6: P$1 2.25,0; P$2 1.15,0; P$3 0.05,0; P$4 -1.05,0; P$5 -2.15,0; P$6 -3.25,0; P$7 -4.35,0; P$8 -5.45,0; P$13 -6.55,0 | hole 1: -4.4,-10.5; 3.05,-10.5
10118194 = smd 0.4 x 1.35: 1 -1.3,2.7; 2 -0.65,2.7; 3 0,2.7; 4 0.65,2.7; 5 1.3,2.7 | drill 0.8: SH1 -2.5,2.7; SH2 2.5,2.7 | drill 1: SH3 -3.5,0; SH8 3.5,0 | smd 1.5 x 1.55: SH4 -3.05,0; SH5 -1,0; SH6 1,0; SH7 3.05,0
SOD1006X40 = smd 0.495 x 0.32: 1 -0.453,0; 2 0.453,0
CT/CN0603 = smd 1 x 1: 1 -1,0; 2 1,0
QFP-128 = smd 0.2 x 1.6: 1 -6.2,-7.6; 2 -5.8,-7.6; 3 -5.4,-7.6; 4 -5,-7.6; 5 -4.6,-7.6; 6 -4.2,-7.6; 7 -3.8,-7.6; 8 -3.4,-7.6; 9 -3,-7.6; 10 -2.6,-7.6; 11 -2.2,-7.6; 12 -1.8,-7.6; 13 -1.4,-7.6; 14 -1,-7.6; 15 -0.6,-7.6; 16 -0.2,-7.6; 17 0.2,-7.6; 18 0.6,-7.6; 19 1,-7.6; 20 1.4,-7.6; 21 1.8,-7.6; 22 2.2,-7.6; 23 2.6,-7.6; 24 3,-7.6; 25 3.4,-7.6; 26 3.8,-7.6; 27 4.2,-7.6; 28 4.6,-7.6; 29 5,-7.6; 30 5.4,-7.6; 31 5.8,-7.6; 32 6.2,-7.6; 65 6.2,7.6; 66 5.8,7.6; 67 5.4,7.6; 68 5,7.6; 69 4.6,7.6; 70 4.2,7.6; 71 3.8,7.6; 72 3.4,7.6; 73 3,7.6; 74 2.6,7.6; 75 2.2,7.6; 76 1.8,7.6; 77 1.4,7.6; 78 1,7.6; 79 0.6,7.6; 80 0.2,7.6; 81 -0.2,7.6; 82 -0.6,7.6; 83 -1,7.6; 84 -1.4,7.6; 85 -1.8,7.6; 86 -2.2,7.6; 87 -2.6,7.6; 88 -3,7.6; 89 -3.4,7.6; 90 -3.8,7.6; 91 -4.2,7.6; 92 -4.6,7.6; 93 -5,7.6; 94 -5.4,7.6; 95 -5.8,7.6; 96 -6.2,7.6 | smd 1.6 x 0.2: 33 7.6,-6.2; 34 7.6,-5.8; 35 7.6,-5.4; 36 7.6,-5; 37 7.6,-4.6; 38 7.6,-4.2; 39 7.6,-3.8; 40 7.6,-3.4; 41 7.6,-3; 42 7.6,-2.6; 43 7.6,-2.2; 44 7.6,-1.8; 45 7.6,-1.4; 46 7.6,-1; 47 7.6,-0.6; 48 7.6,-0.2; 49 7.6,0.2; 50 7.6,0.6; 51 7.6,1; 52 7.6,1.4; 53 7.6,1.8; 54 7.6,2.2; 55 7.6,2.6; 56 7.6,3; 57 7.6,3.4; 58 7.6,3.8; 59 7.6,4.2; 60 7.6,4.6; 61 7.6,5; 62 7.6,5.4; 63 7.6,5.8; 64 7.6,6.2; 97 -7.6,6.2; 98 -7.6,5.8; 99 -7.6,5.4; 100 -7.6,5; 101 -7.6,4.6; 102 -7.6,4.2; 103 -7.6,3.8; 104 -7.6,3.4; 105 -7.6,3; 106 -7.6,2.6; 107 -7.6,2.2; 108 -7.6,1.8; 109 -7.6,1.4; 110 -7.6,1; 111 -7.6,0.6; 112 -7.6,0.2; 113 -7.6,-0.2; 114 -7.6,-0.6; 115 -7.6,-1; 116 -7.6,-1.4; 117 -7.6,-1.8; 118 -7.6,-2.2; 119 -7.6,-2.6; 120 -7.6,-3; 121 -7.6,-3.4; 122 -7.6,-3.8; 123 -7.6,-4.2; 124 -7.6,-4.6; 125 -7.6,-5; 126 -7.6,-5.4; 127 -7.6,-5.8; 128 -7.6,-6.2 | drill 2.2: P$2 0,0
SO08-208 = smd 0.66 x 2.032: 1 -1.905,-3.498; 2 -0.635,-3.498; 3 0.635,-3.498; 4 1.905,-3.498; 5 1.905,3.498; 6 0.635,3.498; 7 -0.635,3.498; 8 -1.905,3.498
SOT95P280X110-6 = smd 1.259 x 0.609: 1 -1.228,0.95; 2 -1.228,0; 3 -1.228,-0.95; 4 1.228,-0.95; 5 1.228,0; 6 1.228,0.95
QFN40P600X600X80-49T405 = smd 0.938 x 0.22: 1 -2.996,2.2; 2 -2.996,1.8; 3 -2.996,1.4; 4 -2.996,1; 5 -2.996,0.6; 6 -2.996,0.2; 7 -2.996,-0.2; 8 -2.996,-0.6; 9 -2.996,-1; 10 -2.996,-1.4; 11 -2.996,-1.8; 12 -2.996,-2.2; 25 2.996,-2.2; 26 2.996,-1.8; 27 2.996,-1.4; 28 2.996,-1; 29 2.996,-0.6; 30 2.996,-0.2; 31 2.996,0.2; 32 2.996,0.6; 33 2.996,1; 34 2.996,1.4; 35 2.996,1.8; 36 2.996,2.2 | smd 0.22 x 0.938: 13 -2.2,-2.996; 14 -1.8,-2.996; 15 -1.4,-2.996; 16 -1,-2.996; 17 -0.6,-2.996; 18 -0.2,-2.996; 19 0.2,-2.996; 20 0.6,-2.996; 21 1,-2.996; 22 1.4,-2.996; 23 1.8,-2.996; 24 2.2,-2.996; 37 2.2,2.996; 38 1.8,2.996; 39 1.4,2.996; 40 1,2.996; 41 0.6,2.996; 42 0.2,2.996; 43 -0.2,2.996; 44 -0.6,2.996; 45 -1,2.996; 46 -1.4,2.996; 47 -1.8,2.996; 48 -2.2,2.996 | smd 4.05 x 4.05: 49 0,0 | drill 0.6: P$1 0,0; P$2 1.4,0; P$3 -1.4,0; P$4 -1.4,1.4; P$5 0,1.4; P$6 1.4,1.4; P$7 1.4,-1.4; P$8 0,-1.4; P$9 -1.4,-1.4
HRS_U.FL-R-SMT(01) = smd 1.1 x 2.25: 1 -1.475,0; 2 1.475,0 | smd 1.05 x 1.1: 3 0,-1.55
L3230M = smd 1.2 x 2.7: 1 -1.4,0; 2 1.4,0
321015RGB = smd 0.5 x 0.8: 1 -0.415,0.4; 4 0.415,0.4 | smd 0.95 x 1.1: 2 -1.475,0; 3 1.475,0
3.2X2.5_KX-7 = smd 1.3 x 1.1: 1 -1.15,-0.9; 2 1.15,-0.9; 3 1.15,0.9; 4 -1.15,0.9
3.2X1.5 = smd 1 x 1.8: 1 -1.25,0; 2 1.25,0
R0402 = smd 0.6 x 0.7: 1 -0.5,0; 2 0.5,0
R0603 = smd 1 x 1.1: 1 -0.85,0; 2 0.85,0
R0805 = smd 1.3 x 1.5: 1 -0.95,0; 2 0.95,0
SW_PTS840GMSMTRLFS = smd 1.4 x 1.05: 1 -1.9,0.725; 2 1.9,0.725; 3 -1.9,-0.725; 4 1.9,-0.725 | smd 1.1 x 0.5: 5 0,1.7 | drill 0.65 pad 0.7: P$1 -2,-0.8; P$2 2,-0.8 | hole 0.7: 0,-0.9; 0,0.9
MCPL3-AC-V = smd 1.9 x 1.8: 1 -2.5,-0.9; 2 0,-0.9; 3 2.5,-0.9 | smd 1.6 x 1.5: 4 5.4,3.85; 5 -5.4,3.85 | hole 1.1: -2.5,2.9; 2.5,2.9
MA18-2 = drill 1.016 octagon: 1 -21.59,-1.27; 2 -21.59,1.27; 3 -19.05,-1.27; 4 -19.05,1.27; 5 -16.51,-1.27; 6 -16.51,1.27; 7 -13.97,-1.27; 8 -13.97,1.27; 9 -11.43,-1.27; 10 -11.43,1.27; 11 -8.89,-1.27; 12 -8.89,1.27; 13 -6.35,-1.27; 14 -6.35,1.27; 15 -3.81,-1.27; 16 -3.81,1.27; 17 -1.27,-1.27; 18 -1.27,1.27; 19 1.27,-1.27; 20 1.27,1.27; 21 3.81,-1.27; 22 3.81,1.27; 23 6.35,-1.27; 24 6.35,1.27; 25 8.89,-1.27; 26 8.89,1.27; 27 11.43,-1.27; 28 11.43,1.27; 29 13.97,-1.27; 30 13.97,1.27; 31 16.51,-1.27; 32 16.51,1.27; 33 19.05,-1.27; 34 19.05,1.27; 35 21.59,-1.27; 36 21.59,1.27
MA04-2 = drill 1.016 octagon: 1 -3.81,-1.27; 2 -3.81,1.27; 3 -1.27,-1.27; 4 -1.27,1.27; 5 1.27,-1.27; 6 1.27,1.27; 7 3.81,-1.27; 8 3.81,1.27
B1,27 = smd 1.27 x 1.27: TP 0,0
DFN200X300X60-7N = smd 0.5 x 0.75: 1 -1.35,0.6; 6 1.35,0.6 | smd 0.5 x 0.4: 2 -1.35,-0.175; 3 -1.35,-0.775; 4 1.35,-0.775; 5 1.35,-0.175 | smd 1.8 x 1.8: 7 0,0
QFN90P1200X1200X100-44 = smd 1.26 x 0.37: 1 -5.835,4.5; 2 -5.835,3.6; 3 -5.835,2.7; 4 -5.835,1.8; 5 -5.835,0.9; 6 -5.835,0; 7 -5.835,-0.9; 8 -5.835,-1.8; 9 -5.835,-2.7; 10 -5.835,-3.6; 11 -5.835,-4.5; 23 5.835,-4.5; 24 5.835,-3.6; 25 5.835,-2.7; 26 5.835,-1.8; 27 5.835,-0.9; 28 5.835,0; 29 5.835,0.9; 30 5.835,1.8; 31 5.835,2.7; 32 5.835,3.6; 33 5.835,4.5 | smd 0.37 x 1.26: 12 -4.5,-5.835; 13 -3.6,-5.835; 14 -2.7,-5.835; 15 -1.8,-5.835; 16 -0.9,-5.835; 17 0,-5.835; 18 0.9,-5.835; 19 1.8,-5.835; 20 2.7,-5.835; 21 3.6,-5.835; 22 4.5,-5.835; 34 4.5,5.835; 35 3.6,5.835; 36 2.7,5.835; 37 1.8,5.835; 38 0.9,5.835; 39 0,5.835; 40 -0.9,5.835; 41 -1.8,5.835; 42 -2.7,5.835; 43 -3.6,5.835; 44 -4.5,5.835
SOT25 = smd 0.55 x 0.8: 1 -0.95,-1.2; 2 0,-1.2; 3 0.95,-1.2; 4 0.95,1.2; 5 -0.95,1.2
BGA8C40P2X4_99X159X42 = smd 0.24 x 0.24: A1 -0.2,0.6; A2 0.2,0.6; B1 -0.2,0.2; B2 0.2,0.2; C1 -0.2,-0.2; C2 0.2,-0.2; D1 -0.2,-0.6; D2 0.2,-0.6
FH21-15S-1DS = drill 0.813: 1 -7,0; 2 -6,2; 3 -5,0; 4 -4,2; 5 -3,0; 6 -2,2; 7 -1,0; 8 0,2; 9 1,0; 10 2,2; 11 3,0; 12 4,2; 13 5,0; 14 6,2; 15 7,0

### Placement (x,y rotation side)
C1  62.6,18.8 270 top
C2  40,29.4 135 top
C3  41.51,14.36 225 top
C4  37.84,18.04 225 top
C5  41.02,9.86 225 top
C6  37.63,13.25 225 top
C7  43.2,10.6 270 top
C8  58.6,33.2 90 top
C9  54.21,11.75 225 top
C10  44,33.4 135 top
C11  43,32.4 135 top
C12  41,30.4 135 top
C13  36,25.4 135 top
C14  10.2,33 180 top
C15  9.4,27.6 90 top
C16  65.4,36.9 270 top
C17  43.35,12.52 225 top
C18  57.2,33.2 90 top
C19  64.6,19.2 0 top
C20  38,27.4 135 top
C21  37,26.4 135 top
C22  35.29,20.59 225 top
C23  36.14,19.74 225 top
C24  17.95,9.85 270 top
C25  42.36,13.51 225 top
C26  35.02,29.67 135 top
C27  35.87,30.52 135 top
C28  17.85,19.2 0 top
C29  18.8,22 0 top
C30  20.2,31.8 270 top
C31  27.7,17.2 180 top
C32  27.7,19.15 180 top
C33  30.6,28.8 0 top
C34  32,23.25 180 top
C35  21.8,32 90 top
C36  27.4,32.6 270 top
C37  30.75,31.85 180 top
C38  30.6,30.15 180 top
C39  30.75,33.4 180 top
C40  18.8,28.2 180 top
C41  39,28.4 135 top
C42  3.5,22.2 180 top
C43  17.8,31.8 90 top
C44  18.8,27 180 top
C45  63.4,2 180 top
C46  66.2,0.8 180 top
C47  66.4,2.2 180 top
C48  18.05,23.25 0 top
C49  18.6,25.4 0 top
C50  21,19.2 0 top
C51  21.4,17 180 top
C52  9.6,22.2 180 top
C53  6.6,32.75 180 top
C54  12.6,31.8 270 top
C55  28.6,15.2 180 top
C56  14.4,22.2 180 top
C57  15.8,30.2 0 top
C58  60.6,29.8 90 top
C59  56,33.2 90 top
C60  42,31.4 135 top
C61  44.8,11.2 270 top
C62  46.4,11 270 top
C63  57.2,8.2 270 top
C64  56.4,11 270 top
C65  64.6,20.6 0 top
C66  54.2,8.4 270 top
C67  55.6,8.4 270 top
C68  40.2,15.2 225 top
C69  57.4,13.4 270 top
C70  64.6,17.8 0 top
C71  70.8,25.2 0 top
C72  70.8,22.8 0 top
CON1  15,13 270 top
CON2  1.6,30.2 270 top
D1  18,7.8 90 top
D2  18,5.6 270 top
D3  18,3.8 90 top
D4  17.5,11.65 0 top
D5  17,13 270 top
D6  17.05,14.95 90 top
D7  17,17.4 270 top
D8  16.95,10.05 90 top
D9  8.1,33.85 0 top
D10  6.45,31.4 90 top
D11  6.45,29.65 270 top
D12  6.45,28 90 top
F1  6.3,34.95 90 top
IC1  50,22 135 top
IC2  26.4,11.6 270 top
IC3  14.8,27.8 180 top
IC4  24.8,25 180 top
J1  72.4,2.55 270 top
L1  31.15,18.15 270 top
L2  31.95,26 90 top
L3  24.55,32.6 180 top
L4  9.6,24.6 180 top
L5  14.4,24.6 0 top
LED1  1,23 270 top
Q1  35.68,15.2 315 top
Q2  39.32,11.55 315 top
R1  34.18,28.82 315 top
R2  36.72,31.37 315 top
R3  36.99,18.89 45 top
R4  10.6,27.6 270 top
R5  8.2,27.6 270 top
R6  62.3,36.2 0 top
R7  65.3,38.9 270 top
R8  59.8,37.3 270 top
R9  18,13 270 top
R10  18,15.2 90 top
R11  17,3.8 90 top
R12  17,5.6 270 top
R13  17,7.6 90 top
R14  18,17.4 270 top
R15  24.65,18.1 90 top
R16  12.5,33.95 180 top
R17  19,31.6 90 top
R18  68.8,2 270 top
R19  20,23.5 270 top
R20  5.4,26 270 top
R21  6.4,26 270 top
R22  31.8,20.85 180 top
R23  19.2,29.2 180 top
R24  18.2,20.4 180 top
R25  13,29.8 180 top
R26  12.2,28.2 270 top
R27  37.6,32.2 315 top
S1  59,-5.3 0 top  (outside the outline)
S2  47.12,7.61 180 top
SV1  30,37 180 bottom
SV2  12,3 0 top
TP4  -3,-4 90 top  (outside the outline)
TP5  2,-4 90 top  (outside the outline)
TP6  7,-4 90 top  (outside the outline)
TP7  12,-4 90 top  (outside the outline)
TP8  14,-2 90 top
TP9  4,-2 0 top
TP10  9,-2 0 top
TP17  66,6.8 0 top
TP18  47,20.6 0 top
TP22  44,-3.2 0 top  (outside the outline)
TP23  60.6,25.4 0 top
TP25  50.2,25.2 0 top
TP26  56.8,42.2 0 top
TP28  54.4,23.2 0 top
TP29  53.8,21 0 top
U1  62.5,38.3 180 top
U3  65.2,10 90 top
U4  15.2,32.6 90 top
U10  9.8,30.6 180 top
U40  3.5,23.9 270 top
X1  30.6,3.6 0 top

### Tracks (layer width: path | path; a pad name or v marks a point on that pad's centre or on a via)
!BUS_RST  (via drill 0.3)  (1 unrouted)
  Top 0.2: IC4.25 19.8,29.2 R23.1 19.51,29.2 18.74,29.97 v17.96,29.97
  Route2 0.2: SV1.7 17.4,36.9 17.4,33.8 17.96,33.24 v17.96,29.97 22.23,29.97 23.4,28.8 30.4,28.8 32.2,27
+1V2  (via drill 0.3)  (24 unrouted)
  Top 0.2: 29,26.4 IC4.10 | IC1.64 39.25,23.98 37.42,23.98 C13.1 36.46,25.94 v35.51,26.89 | IC1.80 43.49,15.78 43.49,14.93 43.81,14.61 C17.1 | v38.51,29.89 39.46,28.94 C2.1 40.46,27.3 IC1.56 43.11,24.65 43.11,24.31 42.8,24 42.63,24 IC1.58 | C11.1 43.36,32.04 42.37,32.04 v41.52,32.89 v41.51,32.89 | C10.1 43.46,32.94 v42.51,33.89
  Top 0.3: 29,26.4 30.2,26.4 31.2,27.4 L2.2
  Top 0.6: 31.2,27.4 31.45,27.65 C33.2 v32.6,28.8
+1V8  (via drill 0.3)  (14 unrouted)
  Top 0.2: 42.24,20.18 IC1.70 40.81,18.75 | 42.8,19.61 IC1.72 41.52,18.32 41.23,18.32 40.95,18.61 | IC1.79 42.93,15.78 42.93,14.08 C25.1 | IC1.69 40.95,19.45 | 39.53,20.3 39.53,20.02 | 39.53,20.3 39.53,20.02 | 39.53,20.3 IC1.65 39.53,20.3 | 40.1,19.45 39.96,19.6 | 40.1,19.45 39.96,19.6 | 40.1,19.45 39.96,19.6 | 40.1,19.45 39.96,19.6 | 39.96,19.6 39.68,19.88 | 39.96,19.6 39.68,19.88 | 39.96,19.6 39.68,19.88 | 39.68,19.88 39.53,20.02 | 39.68,19.88 39.53,20.02 | 39.68,19.88 39.53,20.02 | 39.68,19.88 IC1.66 39.68,19.88 | 39.96,19.6 IC1.67 39.96,19.6 | 40.24,19.31 40.1,19.45 | 40.24,19.31 40.1,19.45 | 40.24,19.31 40.1,19.45 | 40.52,19.03 40.24,19.31 | 40.52,19.03 40.24,19.31 | 40.52,19.03 40.24,19.31 | 40.81,18.75 40.52,19.03 | 40.81,18.75 40.52,19.03 | 40.95,18.61 40.81,18.75 | 40.95,18.61 40.81,18.75 | 40.24,19.31 IC1.68 40.24,19.31 | IC1.69 40.52,19.03 | IC1.69 40.52,19.03 | IC1.62 40.1,24.26 40.1,24.55 | IC1.59 40.95,25.11 40.67,25.11 40.52,24.97 | 40.24,24.69 40.1,24.55 | 40.24,24.69 40.1,24.55 | 40.52,24.97 40.24,24.69 | 40.52,24.97 40.24,24.69 | 40.52,24.97 IC1.60 40.52,24.97 | IC1.61 40.24,24.69 | IC1.61 40.24,24.69 | IC1.61 40.24,24.69 | C21.1 37.46,26.94 v36.51,27.89
  Top 0.3: 39.53,20.3 36.71,20.3 C23.1 | C23.1 C22.1 C23.1
  Top 0.4: C52.1 v11.6,22.2 | C21.1 C20.1 40.43,24.97 40.52,24.97
  Top 0.6: C52.1 10.45,22.35 L4.2 8.4,24.6 9.4,25.6 C15.1 9.55,27.1 R4.2
  Route15 0.6: 32.6,14.8 19.6,14.8 12.2,22.2 v11.6,22.2
+3V0  (via drill 0.3)  (6 unrouted)
  Top 0.2: IC4.12 28,27.4 28,28
  Top 0.3: 28,28 28,29.88 29.9,31.78 C37.2 30.69,32.64 v30.74,32.64
+3V3  (via drill 0.3)  (23 unrouted)
  Top 0.2: IC4.13 27,28.8 27.4,29.2 | IC4.17 25.4,28.8 25.8,29.2 25.8,30.03 25.8,30.2 25.6,30.4 | v37.51,28.89 38.46,27.94 C41.1 39.46,27.73 IC1.57 | C60.1 41.46,30.94 v40.51,31.89
  Top 0.24: v1,25.6 LED1.2 | U40.A2 4.15,23.65 C42.1 v5,22.2
  Top 0.3: 27.4,29.2 27.4,30 29,31.6 29,32.5 C39.2 29.7,33.6 v28.4,33.6 | 25.6,30.4 24.2,31.8 23.4,31.8 23.15,32.05 L3.2
  Top 0.4: v4.4,25.6 4.5,25.5 R20.2
  Top 0.6: L3.2 22.9,32.85 C35.2 v21.8,33.9
  Route15 0.24: v4.4,25.6 3.6,24.8 1.8,24.8 v1,25.6
  Route15 0.4: SV1.2 5.6,32.92 5.6,27.4 4.8,26.6 4.8,26 v4.4,25.6 5,25 v5,22.2
  Route15 0.6: SV1.2 9.68,37 19.08,37 19.89,36.19 19.89,34.91 20.54,34.26 21.44,34.26
  Route15 0.8: 21.44,34.26 v21.8,33.9 28.1,33.9 28.34,33.66 28.4,33.66
+5V
  Top 0.3: R25.1 13.9,30.2 C57.1
  Top 0.6: IC3.5 14.4,27.8 14.95,28.35 14.95,29.24 14.95,29.25 C57.1 14.95,30.7 U4.5
AP_WAKE_BT  (via drill 0.3)  (1 unrouted)
  Top 0.2: IC4.3 28.4,23.6 29.05,22.95 29.05,21.55 v29.6,21
BAT_M  (3 unrouted)
BAT_MINUS  (2 unrouted)
BAT_PLUS  (via drill 0.3)  (2 unrouted)
  Top 0.2: IC4.39 23.4,21.4 23.1,21.1 23,21.2 IC4.38 | IC4.42 24.6,20.8 23.4,19.6 23.4,19.21
  Top 0.3: v18.8,18.2 18.7,18.3 C28.2 19.89,20.39 22.39,20.39 23.1,21.1 | 23.4,19.21 23.4,18.2 24.45,17.15 R15.1 24.55,17.15 24,16.6 v23.4,16.6
  Route15 0.6: v23.4,16.6 23,16.2 20.8,16.2 v18.8,18.2 17.6,18.2 15.8,20 15.8,25.2 12.4,28.6 12.4,34.28 SV1.4
BAT_TS  (via drill 0.3)  (1 unrouted)
  Top 0.2: IC4.37 22.6,21.4 22.2,21 v21,21 19.3,21 R24.1
BUS_I2C_SCL  (via drill 0.3)  (3 unrouted)
  Top 0.2: IC4.2 28.3,23.2 28.6,22.9 28.6,21.85 28.6,21.2 v28.8,21 | U40.C1 3.3,25.7 3,26 v3,26.2
  Route2 0.2: v3,26.2 3.2,26 3.2,24.8
BUS_I2C_SDA  (via drill 0.3)  (3 unrouted)
  Top 0.2: 28.2,22.8 IC4.1 27.8,21.2 v28,21 | U40.B1 3.7,26.1 v3.8,26.2
  Route2 0.2: v3.8,26.2 3.8,24.8
BUS_SPI_CLK  (2 unrouted)
BUS_SPI_CS  (1 unrouted)
BUS_SPI_MISO  (2 unrouted)
BUS_SPI_MOSI  (via drill 0.3)  (2 unrouted)
  Top 0.2: IC1.55 41.02,27.3 v41.02,27.6
  Route2 0.2: v41.02,27.6 41.02,28.18 37.8,31.4
BUS_UART1_RXD  (1 unrouted)
BUS_UART1_TXD  (1 unrouted)
BUS_VEXT  (via drill 0.3)
  Top 0.2: IC4.32 21.2,24.4 21,24.2 21.2,24 IC4.33
  Top 0.3: 21,24.2 20.6,24.2 20.3,24.2 20.1,24 20.05,23.95 | 20.05,23.95 R19.1 | 20.05,23.95 19.6,24.4 v18.6,24.4
  Route2 0.6: SV1.3 12.2,37.02 14.18,37.02 14.8,36.4 14.8,34 16.6,32.2 16.6,30 18.6,28 v18.6,24.4
CSI_CK_N  (1 unrouted)
CSI_CK_P  (1 unrouted)
CSI_D0_N  (1 unrouted)
CSI_D0_P  (1 unrouted)
CSI_D1_N  (1 unrouted)
CSI_D1_P  (1 unrouted)
CSI_MCLK  (1 unrouted)
CSI_RESET  (1 unrouted)
CSI_SCK  (1 unrouted)
CSI_SDA  (1 unrouted)
EXTEN  (via drill 0.3)  (1 unrouted)
  Top 0.2: IC4.20 24.2,29.2 24,29.4 v24,29.7
GND  (via drill 0.3)  (74 unrouted)
  Top 0.2: IC4.9 26.6,26 26.4,26.2 | 26.4,26.2 IC4.P$9 | IC4.P$4 IC4.46 | IC4.16 25.8,26.8 26.4,26.2 | IC4.22 IC4.P$7 | C40.2 C44.2 | R24.2 v16.8,20.4 | U40.D1 2.9,25.1 v2.6,25.4 | D7.2 17,16.3 v17.15,16.15
  Top 0.24: C42.2 2.2,21.55 v2.2,21.4
  Top 0.3: C33.1 29.95,28.8 31.3,30.15 C38.1 | C36.1 28.05,32.8 v28.4,32.8 | C30.2 19.25,32.1 R17.2 | R17.2 18.4,32.1 18.05,32.45 C43.2 | v19,33 R17.2 | C29.1 17.6,22 | 17.6,22 v16.8,22 | C48.1 17.6,22.85 17.6,22 | C28.1 17.7,19.9 R24.2 | C32.1 28.55,18.25 | v28.6,18.2 28.55,18.25 | 28.55,18.25 C31.1 | C51.2 20.75,17.88 v20.43,18.2 | R26.2 v12.2,26.8 | D11.2 D12.2 6.95,28.45 v7.2,28.2
  Top 0.4: C40.2 v17.2,28.2 | CON2.5 CON2.SH2 | CON2.SH1 4.35,32.75 C53.2 6.45,32.25 D10.2 | v9.4,34.2 8.9,34.2 D9.2 9.35,33.05 | 9.35,33.05 C14.2 | U10.2 9.8,32.6 9.35,33.05 | R5.2 8.05,27.1 7.2,27.95 v7.2,28.2 | C52.2 v7.6,22.2 | C54.2 13.45,30.95 v13.6,30.8
  Top 0.6: v22.8,30.6 22.35,30.6 22.25,30.7 C35.1 | C50.1 20.43,19.2 v20.43,18.2 | C33.1 29.75,27.65 v29.8,27.6 | C39.1 C37.1 32.55,31.85 v32.6,31.8 | C49.1 17.6,25.4 v17.6,24.4 | IC3.2 16.8,27.8 v17.2,28.2 17.15,28.25 17.15,29.7 C57.2 | U4.2 17.65,32.6 C43.2
  pour Bottom (isolate 0.3, rank 6, no thermals): -1,41 -1,-1 81,-1 81,41
GPIO2  (2 unrouted)
  Top 0.2: IC4.5 28.65,24.4 29.75,23.3 | 30.4,21.7 29.75,22.34 29.75,23.24
IPS  (via drill 0.3)  (3 unrouted)
  Top 0.2: IC4.40 23.8,21.2 21.85,19.25 C50.2 | 25.6,20.2 25.4,20.4 IC4.44 | IC4.14 26.6,29.8 27.4,30.6 C36.2 | IC4.21 23.8,28.8 23.6,29 | IC4.7 28.44,25.2 28.45,25.2 29,25.2 30.95,23.25 C34.2 | IC4.29 v20.6,25.6 | IC4.34 21.2,23.6 21,23.4 21.2,23.2 IC4.35
  Top 0.25: 21,23.4 20.8,23.2 20.8,22.6 20.4,22.2 19.8,22.2 19.65,22.05 C29.2
  Top 0.3: 26.45,19.35 25.6,20.2 | C36.2 28.14,31.75 v28.39,32 | 23.6,29 22.8,29.8 21.67,29.8 21,30.48 21,31.8 20.35,32.45 C30.1 v20.2,33.4 | C29.2 19.43,22 18.62,21.2 17.27,21.2 v16.8,21.2 | C50.2 21.6,18.95 v21.6,18.2 | C32.2 26.85,18.95 v27.6,18.2 | C34.2 31.95,22.45 33.75,22.45 v33.8,22.4
  Top 0.4: U10.1 10.75,32.7 C14.1 10.8,33.25 v10.8,34.2
  Top 0.6: v16.8,21.2 16.25,21.2 C56.1 13,24.45 L5.1 13.57,25.17 IC3.6
  Route2 0.6: v10.8,34.2 12.4,32.6 13,32.6 15,30.6 15,22.2 16,21.2 v16.8,21.2
  Route15 0.6: v16.8,21.2 18.8,21.2 20.6,23 | v20.2,33.4 21.76,31.84
  Route15 1: 22.2,18.8 22.2,21.4 20.6,23 v20.6,25.6 20.6,30.68 21.76,31.84 28.39,31.84 28.6,31.62 28.6,24.8 31,22.4 v33.8,22.4 | 22.2,18.8 v21.6,18.2 | v27.6,18.2 27,18.8 22.2,18.8
LDO3  (via drill 0.3)  (1 unrouted)
  Top 0.2: IC4.41 24.2,21 22.95,19.75
  Top 0.3: 22.95,19.75 22.8,19.6 22.8,18.2 22.05,17.45 C51.1 22.83,17 v23.2,17.37
LDO4  (via drill 0.3)  (3 unrouted)
  Top 0.2: IC4.11 28.27,26.8 28.6,27.13
  Top 0.3: 28.6,27.13 28.6,29.38 29.02,29.8 29.4,29.8 C38.2 30.55,30.95 32.12,30.95 32.54,30.54 32.6,30.48 v32.6,30.2
LED_BLUE
  Top 0.2: U40.D2 2.85,23.65 2.15,23.65 1.91,23.41 LED1.1
LED_GREEN
  Top 0.2: U40.C2 3.3,23.47 3.13,23.3 2.29,23.3 1.58,22.59 LED1.4
LED_RED
  Top 0.2: U40.B2 3.7,23.1 3.5,22.9 2.44,22.9 2.15,22.61 2.15,22.33 1.35,21.52 LED1.3
N$1  (5 unrouted)
N$2  (1 unrouted)
  Top 0.2: CON1.P$4 15.25,13.8 15.8,13.8 16.2,13.4 16.2,11.25 D8.2
N$3
  Top 0.2: 26.2,30.2 IC4.15 | 26.15,32.4 L3.1
  Top 0.3: 26.2,30.2 26.2,32.35 26.15,32.4
N$4  (via drill 0.3)  (1 unrouted)
  Top 0.2: IC4.18 25,29.5 v25.2,29.7
N$5  (via drill 0.3)  (1 unrouted)
  Top 0.2: IC4.19 24.6,29.3 24.6,30.4 v24.65,30.45
N$6
  Top 0.4: U10.5 11.35,28.8 11.35,24.95 L4.1
N$7
  Top 0.3: CON2.1 3.5,31.5 3.2,31.8
  Top 0.4: 3.2,31.8 3.2,33.2 5.95,35.95 F1.2
N$8
  Top 0.6: U10.4 8.2,28.75 R5.1 8.35,28.25 C15.2 10.45,28.25 R4.1
N$13  (2 unrouted)
N$14
  Top 0.6: L5.2 15.8,26.62 IC3.1
N$17
  Top 0.2: 28.61,25.6 IC4.8
  Top 0.3: 28.61,25.6 30.4,25.6 31.4,24.6 L2.1
N$18  (1 unrouted)
N$19
  Top 0.3: IC3.4 12.25,28.75 | 12.25,28.75 R26.1 | R25.2 12.25,29.55 12.25,28.75
N$20
  Top 0.2: IC4.45 25.8,20.8 26.4,20.2 27.4,20.2
  Top 0.3: 27.4,20.2 30.5,20.2 L1.1
N$21  (1 unrouted)
  Top 0.2: IC4.43 25,20
  Top 0.3: L1.2 31,16.75 | 31,16.75 30.4,16.75 | 25,20 25,19.4 R15.2 25,19.05 C31.2 27.65,16.4 30.65,16.4 31,16.75
N$23  (1 unrouted)
N$24  (1 unrouted)
N$25  (1 unrouted)
N$31  (via drill 0.3)
  Top 0.2: IC4.4 28.5,24 29.4,23.1 29.4,22 v30.4,21 30.55,20.85 R22.2
N$37  (1 unrouted)
N$38  (1 unrouted)
N$39  (1 unrouted)
  Top 0.2: IC1.91
N$40  (1 unrouted)
N$41  (1 unrouted)
N$48  (1 unrouted)
N$49  (2 unrouted)
N$50  (2 unrouted)
N$68
  Top 0.3: R19.2 19.15,23 C48.2
PMU_IRQ  (via drill 0.3)  (1 unrouted)
  Top 0.2: IC4.48 27,21.6 27,21.2 v27.2,21
PWR_ON  (via drill 0.3)  (1 unrouted)
  Top 0.2: v26.4,21 26.4,21.13 26.6,21.33 IC4.47
RCC_HSE_IN  (2 unrouted)
RCC_HSE_OUT  (2 unrouted)
RCC_LSE_IN  (2 unrouted)
  Top 0.2: C5.1 41.13,10.67
RCC_LSE_OUT  (2 unrouted)
SDC0_CLK  (1 unrouted)
  Top 0.2: CON1.P$5 15.45,15.15 16.19,14.41 16.19,13.96 16.59,13.56 16.59,12.16 17.05,11.7 D4.1 17.5,11.2 18.4,11.2
SDC0_CMD  (3 unrouted)
  Top 0.2: CON1.P$3 13.75,12.95 13.2,12.4 13.2,9.4 14,8.6
SDC0_D0  (2 unrouted)
  Top 0.2: CON1.P$7 15.41,17.35 16.23,16.52 16.23,14.9 16.55,14.6 16.55,14.21 17,13.75 D5.1
SDC0_D1  (2 unrouted)
  Top 0.2: CON1.P$8 15.75,18.45 16.3,17.9 16.3,17.15 16.59,16.86 16.59,15.1 17.05,14.64 D6.1
SDC0_D2  (3 unrouted)
  Top 0.2: CON1.P$1 15,9.6
SDC0_D3  (3 unrouted)
  Top 0.2: CON1.P$2 14.25,11.85 13.8,11.4 13.8,9.6 14.2,9.2
SDC0_DET  (1 unrouted)
  Top 0.2: CON1.P$13 15.65,19.55 16.2,19 16.2,18.59 16.34,18.45 16.35,18.45 16.95,17.85 D7.1 17.05,17.9 R14.1
SDC1_CLK  (1 unrouted)
SDC1_CMD  (1 unrouted)
SDC1_D0  (1 unrouted)
SDC1_D1  (1 unrouted)
SDC1_D2  (1 unrouted)
SDC1_D3  (1 unrouted)
SVREF  (via drill 0.3)  (7 unrouted)
  Top 0.2: v42.93,20.3 IC1.71 | 41.23,22 v41.52,22.28 IC1.63 39,24.8 v37.8,24.8
  Bottom 0.2: v42.93,20.3 41.52,21.72 v41.52,22.28
SZQ
  Top 0.2: R3.2 37.48,19.38 39.04,19.38 40.67,17.76 41.52,17.76 IC1.73
USB_ID  (3 unrouted)
  Top 0.2: 30.85,22.3 30.59,22.3 30.15,22.75 30.15,23.45 28.8,24.8 IC4.6
USB_OTG_D_N  (via drill 0.3)  (1 unrouted)
  Top 0.3: CON2.2 6.35,30.85 D10.1 7.24,30.95 v7.25,30.96
  Route2 0.3: 8.27,29.35 8.21,29.41 | 8.21,29.41 8.01,29.61 8.01,30.39 7.8,30.6 7.44,30.96 v7.25,30.96 | 8.21,29.41 10.5,27.12 10.5,20.72 18.32,12.9
USB_OTG_D_P  (via drill 0.3)  (1 unrouted)
  Top 0.3: CON2.3 6.35,30.2 D11.1 7.19,30.1 v7.25,30.04
  Route2 0.3: 18.08,12.3 9.9,20.48 9.9,26.88 7.79,28.99 7.25,29.53 v7.25,30.04
USB_OTG_ID
  Top 0.3: CON2.4 5.25,29.55 5.6,29.2 5.6,28.4 D12.1 6.45,26.55 R21.1 R20.1
USB_VBUS  (via drill 0.3)
  Top 0.2: IC4.31 20.4,24.8 | 19.32,25.52 C49.2
  Top 0.3: v17.2,27 17.2,26.6 17.59,26.2 18.65,26.2 19.32,25.52 | C49.2 20.05,24.8 20.4,24.8
  Top 0.4: 6.55,33.7 F1.1 7.25,33 C53.1 | C53.1 7.65,33.15 D9.1 | C53.1 8.15,32.75 v8.2,32.8 | v11.4,31 11.4,31.45 C54.1
  Top 0.6: U4.1 15.55,31.65 v15.3,31.9 14.55,32.65 C54.1
  Route15 0.4: v8.2,32.8 9.6,32.8 10.2,32.2 v11.4,31
  Route15 0.6: v17.2,27 15.6,28.6 15.6,30.6 15.3,30.9 v15.3,31.9
VBIAS
  Top 0.2: R17.1 19,31 19.5,30.5 20.1,30.5 21.4,29.2 22.6,29.2 23,28.8 IC4.23
VCC_RTC  (2 unrouted)
  Top 0.2: IC4.28 21.2,26 20.2,27 C44.1 18.8,27.65 18.8,29.1 R23.2
VINT
  Top 0.2: IC4.26 21.2,26.8 | C40.1 19.8,28.2 21.2,26.8 | IC4.27 21.6,26.4 21.2,26.8
VREF
  Top 0.2: IC4.24 22.6,28.5 22.35,28.75 21.25,28.75 19.9,30.1 19.3,30.1 19,30.4 18.4,30.4 17.95,30.85 17.95,31.15 C43.1